# Altium project EPS.PrjPcb (part 2 of 4)

## Sheet EPS_I2C-Repeater.SchDoc: I2C Repeater
size A4; ApprovedBy: (not approved); CheckedBy: (not checked); Author: Piotr Kuligowski; DocumentNumber: PWSat2-xxx-DW-xxx; Revision: 2; SheetNumber: 15; SheetTotal: 51; Model: EM2
Used 2 times, as channels Top/Controller A/I2C Repeater, Top/Controller B/I2C Repeater. Parts and nets are listed once, with the designators drawn on the sheet.
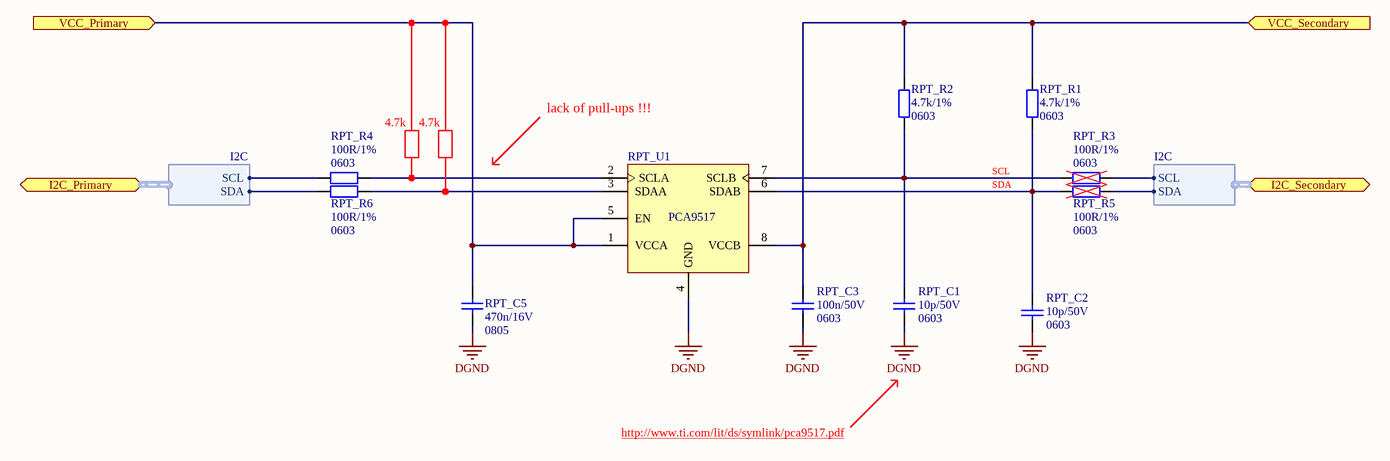
[diagram p9: EPS_I2C-Repeater.SchDoc]

### Parts
RPT_C1  Package: 0603  [SMD_Capacitor_0603]  (hidden comment: 10p/50V)
RPT_C2  Package: 0603  [SMD_Capacitor_0603]  (hidden comment: 10p/50V)
RPT_C3  Package: 0603  [SMD_Capacitor_0603]  (hidden comment: 100n/50V)
RPT_C5  value 470n/16V  Package: 0805  [SMD_Capacitor_0805]  (hidden comment: Cap)
RPT_R1  Package: 0603  [SMD_Resistor_0603]  (hidden comment: 4.7k/1%)
RPT_R2  Package: 0603  [SMD_Resistor_0603]  (hidden comment: 4.7k/1%)
RPT_R3  Package: 0603  [SMD_Resistor_0603]  (hidden comment: 100R/1%)
RPT_R4  Package: 0603  [SMD_Resistor_0603]  (hidden comment: 100R/1%)
RPT_R5  Package: 0603  [SMD_Resistor_0603]  (hidden comment: 100R/1%)
RPT_R6  Package: 0603  [SMD_Resistor_0603]  (hidden comment: 100R/1%)
RPT_U1  PCA9517  [TSSOP8_L]

### Ports
I2C_Primary (harness I2C), I2C_Secondary (harness I2C), VCC_Primary (in), VCC_Secondary (in)

### Harnesses
I2C: SDA, SCL

### Nets
DGND: RPT_C1.2 RPT_C2.2 RPT_C3.1 RPT_C5.2 RPT_U1.4(GND)
VCC_Primary: RPT_C5.1 RPT_U1.1(VCCA) RPT_U1.5(EN) ; port VCC_Primary
VCC_Secondary: RPT_C3.2 RPT_R1.1 RPT_R2.1 RPT_U1.8(VCCB) ; port VCC_Secondary
NetRPT_C1_1: RPT_C1.1 RPT_R2.2 RPT_R3.1 RPT_U1.7(SCLB)
NetRPT_C2_1: RPT_C2.1 RPT_R1.2 RPT_R5.1 RPT_U1.6(SDAB)
NetRPT_R3_2: RPT_R3.2 ; port I2C_Secondary.SCL
NetRPT_R4_1: RPT_R4.1 RPT_U1.2(SCLA)
NetRPT_R4_2: RPT_R4.2 ; port I2C_Primary.SCL
NetRPT_R5_2: RPT_R5.2 ; port I2C_Secondary.SDA
NetRPT_R6_1: RPT_R6.1 RPT_U1.3(SDAA)
NetRPT_R6_2: RPT_R6.2 ; port I2C_Primary.SDA

### Channels
Top/Controller A/I2C Repeater: designators end in _1; ports VCC_Primary=CTRLA_3V3d VCC_Secondary=CTRLA_3V3d
Top/Controller B/I2C Repeater: designators end in _2; ports VCC_Primary=CTRLB_3V3d VCC_Secondary=CTRLB_3V3d

### Notes on the sheet
- 4.7k
- lack of pull-ups !!!
- SCL
- SDA
- http://www.ti.com/lit/ds/symlink/pca9517.pdf
- Title:
- Project:
- Author:
- Model:
- Document Number:
- Checked by:
- Rev:
- Date:
- Approved by:
- Sheet:
- of
- File name:

### Library data of the parts
RPT_C1 RPT_C2 = Cer_GCM1885C1H100JA16D: Ceramic Cap Murata Automotive 10p/50V C0G 0603; Manufacturer: Murata; ManufacturerPartNumber: GCM1885C1H100JA16D; Value: 10p/50V
RPT_C3 = Cer_C0603T104K5RALTU: Ceramic Cap Kemet COTS 100n/50V X7R 0603; Manufacturer: Kemet; ManufacturerPartNumber: C0603T104K5RALTU; Value: 100n/50V
RPT_R1 RPT_R2 = CRCW06034K70FKxxxx: as CTRLA_R2 on sheet EPS_CTRL_A; Manufacturer: Vishay; ManufactuerPartNumber: CRCW06034K70FKxxxx; Value: 4.7k/1%
RPT_R3-RPT_R6 = CRCW0603100RFKxxxx: 100R/1% Vishay CRCW 0603 Resistor. 100mW, 100ppm, 75V.; Manufacturer: Vishay; ManufacturerPartNumber: CRCW0603100RFKxxxx; Value: 100R/1%
RPT_U1 = PCA9517: Level-Translating I2C Bus Repeater; Manufacturer: Texas Instruments; ManufacturerPartNumber: PCA9517

## Sheet EPS_CTRL_AB_Supply.SchDoc: CTRL-A and CTRL-B / Supply
size A4; ApprovedBy: (not approved); CheckedBy: (not checked); Author: Piotr Kuligowski; DocumentNumber: PWSat2-xxx-DW-xxx; Revision: 2; SheetNumber: 16; SheetTotal: 51; Model: EM2
Used 2 times, as channels Top/Controller A/CTRL-A_Supply, Top/Controller B/CTRL-B_Supply. Parts and nets are listed once, with the designators drawn on the sheet.
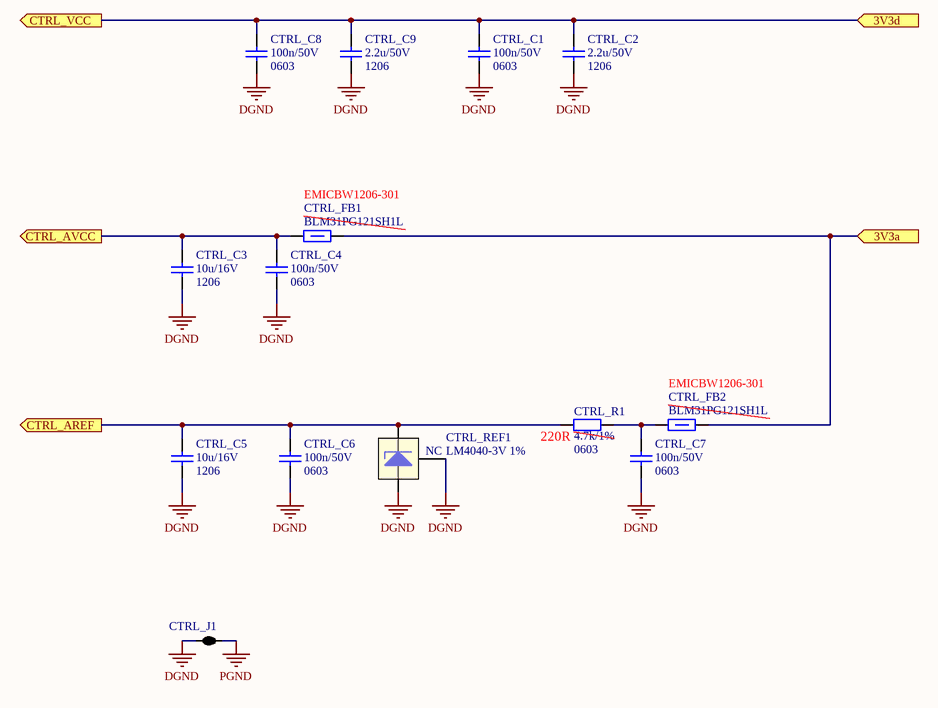
[diagram p10: EPS_CTRL_AB_Supply.SchDoc]

### Parts
CTRL_C1  Package: 0603  [SMD_Capacitor_0603]  (hidden comment: 100n/50V)
CTRL_C2  Package: 1206  [SMD_Capacitor_1206]  (hidden comment: 2.2u/50V)
CTRL_C3  Packge: 1206  [SMD_Capacitor_1206]  (hidden comment: 10u/16V)
CTRL_C4  Package: 0603  [SMD_Capacitor_0603]  (hidden comment: 100n/50V)
CTRL_C5  Packge: 1206  [SMD_Capacitor_1206]  (hidden comment: 10u/16V)
CTRL_C6  Package: 0603  [SMD_Capacitor_0603]  (hidden comment: 100n/50V)
CTRL_C7  Package: 0603  [SMD_Capacitor_0603]  (hidden comment: 100n/50V)
CTRL_C8  Package: 0603  [SMD_Capacitor_0603]  (hidden comment: 100n/50V)
CTRL_C9  Package: 1206  [SMD_Capacitor_1206]  (hidden comment: 2.2u/50V)
CTRL_FB1  120R/100MHz  [SMD_FerriteBead_1206]  (value not drawn)
CTRL_FB2  120R/100MHz  [SMD_FerriteBead_1206]  (value not drawn)
CTRL_J1  2 way net tie junction  [2way_LP]  (value not drawn)  (net tie, no BOM)
CTRL_R1  Package: 0603  [SMD_Resistor_0603]  (hidden comment: 4.7k/1%)
CTRL_REF1  LM4040-3V 1%  [SOT23-3]

### Ports
3V3a (in), 3V3d (in), CTRL_AREF (out), CTRL_AVCC (out), CTRL_VCC (out)

### Nets
DGND: CTRL_C1.2 CTRL_C2.2 CTRL_C3.2 CTRL_C4.2 CTRL_C5.2 CTRL_C6.2 CTRL_C7.2 CTRL_C8.2 CTRL_C9.2 CTRL_J1.2 CTRL_REF1.2(A) CTRL_REF1.3(NC)
PGND: CTRL_J1.1
3V3a: CTRL_FB1.1 CTRL_FB2.1 ; port 3V3a
3V3d: CTRL_C1.1 CTRL_C2.1 CTRL_C8.1 CTRL_C9.1 ; port CTRL_VCC, port 3V3d
CTRL_AREF: CTRL_C5.1 CTRL_C6.1 CTRL_R1.1 CTRL_REF1.1(K) ; port CTRL_AREF
CTRL_AVCC: CTRL_C3.1 CTRL_C4.1 CTRL_FB1.2 ; port CTRL_AVCC
NetCTRL_C7_1: CTRL_C7.1 CTRL_FB2.2 CTRL_R1.2

### Channels
Top/Controller A/CTRL-A_Supply: designators end in _1; ports 3V3a=CTRLA_3V3a 3V3d=CTRLA_3V3d CTRL_AREF=NetCTRL_C5_1_1 CTRL_AVCC=NetCTRL_C3_1_1 CTRL_VCC=CTRLA_3V3d
Top/Controller B/CTRL-B_Supply: designators end in _2; ports 3V3a=CTRLB_3V3a 3V3d=CTRLB_3V3d CTRL_AREF=CTRLB_Vref CTRL_AVCC=NetCTRL_C3_2_1 CTRL_VCC=CTRLB_3V3d

### Notes on the sheet
- (near CTRL_FB1) EMICBW1206-301
- (near CTRL_FB2) EMICBW1206-301
- (near CTRL_R1) 220R
- Title:
- Project:
- Author:
- Model:
- Document Number:
- Checked by:
- Rev:
- Date:
- Approved by:
- Sheet:
- of
- File name:

### Library data of the parts
CTRL_C1 CTRL_C4 CTRL_C6-CTRL_C8 = Cer_C0603T104K5RALTU: Ceramic Cap Kemet COTS 100n/50V X7R 0603; Manufacturer: Kemet; ManufacturerPartNumber: C0603T104K5RALTU; Value: 100n/50V
CTRL_C2 CTRL_C9 = Cer_GCJ31CR71H225KA12L: Ceramic Cap Murata Automotive 2.2u/50V X7R 1206; Manufacturer: Murata; ManufacturerPartNumber: GCJ31CR71H225KA12L; Value: 2.2u/50V
CTRL_C3 CTRL_C5 = Cer_C1206T106K4RACTU: Ceramic Cap Kemet COTS 10u/16V X7R 1206; ManufacturerPartNumber: C1206T106K4RACTU; Manufacturer: Kemet; Value: 10u/16V
CTRL_FB1 CTRL_FB2 = BLM31PG121SH1L: as EMIAB_FB1 on sheet EPS_3V3_EMI-Filter_Out; Package: 1206; Value: 120R/100MHz; ManufacturerPartNumber: BLM31PG121SH1L
CTRL_J1 = 2way: ComponentLink1URL: http://www.edatools.cz/addons; ComponentLink1Description: Source; FootprintNote: LP=12mil, MP=40mil, HP=120mil
CTRL_R1 = Res: Value: 4.7k/1%
CTRL_REF1 = LM4040DIM3-3.0: Shunt V-REF, 3V, 1%, SOT23-3; Manufacturer: Texas Instruments; ManufacturerPartNumber: LM4040DIM3-3.0; HelpUrl: http://www.ti.com/lit/ds/symlink/lm4040-n.pdf; Value: LM4040-3V 1%

## Sheet EPS_Temperature-Sensor.SchDoc: Temperature Sensor
size A4; ApprovedBy: (not approved); CheckedBy: (not checked); Author: P. Kuligowski; DocumentNumber: PWSat2-xxx-DW-xxx; Revision: 2; SheetNumber: 14; SheetTotal: 51; Model: EM2
Used 4 times, as channels Top/Controller A/Temperature-Sensor, Top/Local-Supply and WDTs/Local-Supply CTRL-A/Temperature-Sensor, Top/Local-Supply and WDTs/Local-Supply CTRL-B/Temperature-Sensor, Top/Controller B/Temperature-Sensor. Parts and nets are listed once, with the designators drawn on the sheet.
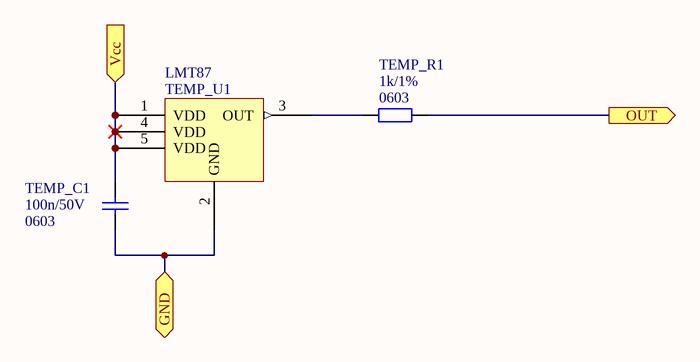
[diagram p11: EPS_Temperature-Sensor.SchDoc]

### Parts
TEMP_C1  Package: 0603  [SMD_Capacitor_0603]  (hidden comment: 100n/50V)
TEMP_R1  Package: 0603  [SMD_Resistor_0603]  (hidden comment: 1k/1%)
TEMP_U1  LMT87  [SC70-LT5_N]

### Ports
GND, OUT (out), Vcc (in)

### Nets
GND: TEMP_C1.2 TEMP_U1.2(GND) ; port GND
OUT: TEMP_R1.2 ; port OUT
Vcc: TEMP_C1.1 TEMP_U1.1(VDD) TEMP_U1.4(VDD) TEMP_U1.5(VDD) ; port Vcc
NetTEMP_R1_1: TEMP_R1.1 TEMP_U1.3(OUT)

### Channels
Top/Controller A/Temperature-Sensor: designators end in _1; ports GND=DGND OUT=CTRLA_HK_TEMP Vcc=NetCTRLA_R21_1
Top/Local-Supply and WDTs/Local-Supply CTRL-A/Temperature-Sensor: designators end in _2; ports GND=PGND OUT=CTRLA_HK_SUPP_TEMP Vcc=NetTEMP_C1_2_1
Top/Local-Supply and WDTs/Local-Supply CTRL-B/Temperature-Sensor: designators end in _3; ports GND=PGND OUT=CTRLB_HK_SUPP_TEMP Vcc=NetTEMP_C1_3_1
Top/Controller B/Temperature-Sensor: designators end in _4; ports GND=DGND OUT=CTRLB_HK_TEMP Vcc=NetCTRLB_R10_1

### Notes on the sheet
- Title:
- Project:
- Author:
- Model:
- Document Number:
- Checked by:
- Rev:
- Date:
- Approved by:
- Sheet:
- of
- File name:

### Library data of the parts
TEMP_C1 = Cer_C0603T104K5RALTU: Ceramic Cap Kemet COTS 100n/50V X7R 0603; Manufacturer: Kemet; ManufacturerPartNumber: C0603T104K5RALTU; Value: 100n/50V
TEMP_R1 = CRCW06031K00FKxxxx: 1k/1% Vishay CRCW 0603 Resistor. 100mW, 100ppm, 75V.; Manufacturer: Vishay; ManufacturerPartNumber: CRCW06031K00FKxxxx; Value: 1k/1%
TEMP_U1 = LMT87: Analog Temperature Sensors with Class-AB Output

## Sheet EPS_MPPT_X.SchDoc: MPPT-X
size A3; ApprovedBy: (not approved); CheckedBy: (not checked); Author: Piotr Kuligowski; DocumentNumber: PWSat2-xxx-DW-xxx; Revision: 2; SheetNumber: 4; SheetTotal: 51; Model: EM2
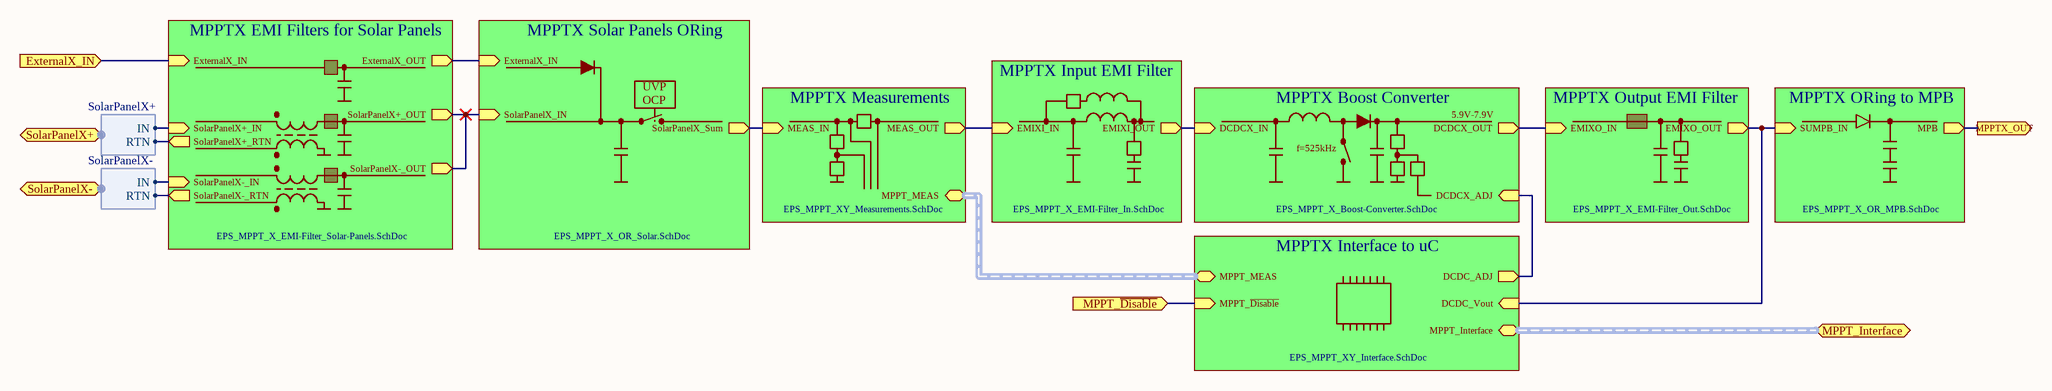
[diagram p12: EPS_MPPT_X.SchDoc]

### Sub-sheets
MPPTX Boost Converter = EPS_MPPT_X_Boost-Converter.SchDoc: DCDCX_IN (in), DCDCX_OUT (out), DCDCX_ADJ (in)
MPPTX EMI Filters for Solar Panels = EPS_MPPT_X_EMI-Filter_Solar-Panels.SchDoc: SolarPanelX+_RTN (out), SolarPanelX-_IN (in), ExternalX_IN (in), SolarPanelX-_RTN (out), SolarPanelX+_IN (in), ExternalX_OUT (out), SolarPanelX-_OUT (out), SolarPanelX+_OUT (out)
MPPTX Input EMI Filter = EPS_MPPT_X_EMI-Filter_In.SchDoc (file not in this document): EMIXI_OUT (out), EMIXI_IN (in)
MPPTX Interface to uC = EPS_MPPT_XY_Interface.SchDoc: MPPT_Interface (harness MPPT_Interface), DCDC_Vout (in), MPPT_MEAS (harness MPPT_MEAS), DCDC_ADJ (out), MPPT_~{Disable} (in)
MPPTX Measurements = EPS_MPPT_XY_Measurements.SchDoc: MEAS_IN (in), MEAS_OUT (out), MPPT_MEAS (harness MPPT_MEAS)
MPPTX ORing to MPB = EPS_MPPT_X_OR_MPB.SchDoc: MPB (out), SUMPB_IN (in)
MPPTX Output EMI Filter = EPS_MPPT_X_EMI-Filter_Out.SchDoc: EMIXO_OUT (out), EMIXO_IN (in)
MPPTX Solar Panels ORing = EPS_MPPT_X_OR_Solar.SchDoc: ExternalX_IN (in), SolarPanelX_Sum (out), SolarPanelX_IN (in)

### Ports
ExternalX_IN (in), MPPT_Interface (harness MPPT_Interface), MPPT_~{Disable} (in), MPPTX_OUT (out), SolarPanelX+ (harness SolarPanelX+), SolarPanelX- (harness SolarPanelX-)

### Harnesses
SolarPanelX+: IN, RTN
SolarPanelX-: IN, RTN

### Nets
PC-104_EXTX: port ExternalX_IN, sheet MPPTX EMI Filters for Solar Panels/ExternalX_IN
NetCTRLB_U1_1: port MPPT_~{Disable}, sheet MPPTX Interface to uC/MPPT_~{Disable}
NetDCDCX_C1_2: sheet MPPTX Boost Converter/DCDCX_IN, sheet MPPTX Input EMI Filter/EMIXI_OUT
NetDCDCX_C2_2: sheet MPPTX Boost Converter/DCDCX_OUT, sheet MPPTX Output EMI Filter/EMIXO_IN
NetDCDCX_R7_2: sheet MPPTX Boost Converter/DCDCX_ADJ, sheet MPPTX Interface to uC/DCDC_ADJ
NetEMIXO_C1_1: sheet MPPTX Interface to uC/DCDC_Vout, sheet MPPTX Output EMI Filter/EMIXO_OUT, sheet MPPTX ORing to MPB/SUMPB_IN
NetEMIXS_C1_1: sheet MPPTX Solar Panels ORing/ExternalX_IN, sheet MPPTX EMI Filters for Solar Panels/ExternalX_OUT
NetEMIXS_C2_1: sheet MPPTX Solar Panels ORing/SolarPanelX_IN, sheet MPPTX EMI Filters for Solar Panels/SolarPanelX-_OUT, sheet MPPTX EMI Filters for Solar Panels/SolarPanelX+_OUT
NetEMIXS_T1_1: sheet MPPTX EMI Filters for Solar Panels/SolarPanelX+_IN, port SolarPanelX+.IN
NetEMIXS_T1_2: sheet MPPTX EMI Filters for Solar Panels/SolarPanelX+_RTN, port SolarPanelX+.RTN
NetEMIXS_T2_1: sheet MPPTX EMI Filters for Solar Panels/SolarPanelX-_IN, port SolarPanelX-.IN
NetEMIXS_T2_2: sheet MPPTX EMI Filters for Solar Panels/SolarPanelX-_RTN, port SolarPanelX-.RTN
NetH3_2: port MPPTX_OUT, sheet MPPTX ORing to MPB/MPB
NetMEAS_R1_1_1: sheet MPPTX Solar Panels ORing/SolarPanelX_Sum, sheet MPPTX Measurements/MEAS_IN
NetMEAS_R1_1_4: sheet MPPTX Measurements/MEAS_OUT, sheet MPPTX Input EMI Filter/EMIXI_IN

### Buses and harness runs
harness port MPPT_Interface = sheet MPPTX Interface to uC/MPPT_Interface
harness sheet MPPTX Interface to uC/MPPT_MEAS = sheet MPPTX Measurements/MPPT_MEAS

### Notes on the sheet
- UVP
- OCP
- f=525kHz
- 5.9V-7.9V
- Title:
- Project:
- Author:
- Model:
- Document Number:
- Checked by:
- Rev:
- Date:
- Approved by:
- Sheet:
- of
- File name:

## Sheet EPS_MPPT_X_Boost-Converter.SchDoc: MPPT-X / Boost-Converter
size A3; ApprovedBy: (not approved); CheckedBy: (not checked); Author: Piotr Kuligowski; DocumentNumber: PWSat2-xxx-DW-xxx; Revision: 2; SheetNumber: 9; SheetTotal: 51; Model: EM2
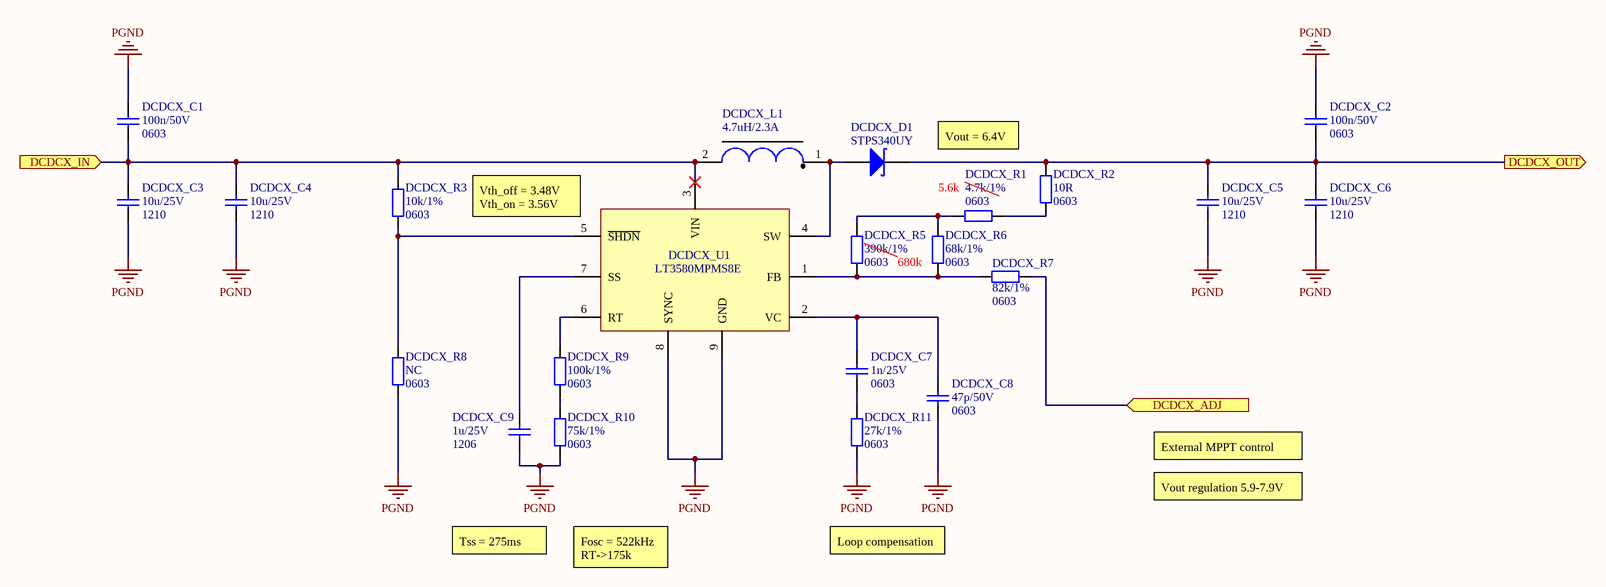
[diagram p13: EPS_MPPT_X_Boost-Converter.SchDoc]

### Parts
DCDCX_C1  Package: 0603  [SMD_Capacitor_0603]  (hidden comment: 100n/50V)
DCDCX_C2  Package: 0603  [SMD_Capacitor_0603]  (hidden comment: 100n/50V)
DCDCX_C3  Package: 1210  [SMD_Capacitor_1210]  (hidden comment: 10u/25V)
DCDCX_C4  Package: 1210  [SMD_Capacitor_1210]  (hidden comment: 10u/25V)
DCDCX_C5  Package: 1210  [SMD_Capacitor_1210]  (hidden comment: 10u/25V)
DCDCX_C6  Package: 1210  [SMD_Capacitor_1210]  (hidden comment: 10u/25V)
DCDCX_C7  value 1n/25V  Package: 0603  [SMD_Capacitor_0603]  (hidden comment: Cap)
DCDCX_C8  value 47p/50V  Package: 0603  [SMD_Capacitor_0603]  (hidden comment: Cap)
DCDCX_C9  Package: 1206  [SMD_Capacitor_1206]  (hidden comment: 1u/25V)
DCDCX_D1  STPS340UY  [DO-214AA]
DCDCX_L1  4.7uH/2.3A  [Coilcraft_MSS6132]
DCDCX_R1  Package: 0603  [SMD_Resistor_0603]  (hidden comment: 4.7k/1%)
DCDCX_R2  Package: 0603  [SMD_Resistor_0603]  (hidden comment: 10R)
DCDCX_R3  Package: 0603  [SMD_Resistor_0603]  (hidden comment: 10k/1%)
DCDCX_R5  Package: 0603  [SMD_Resistor_0603]  (hidden comment: 390k/1%)
DCDCX_R6  Package: 0603  [SMD_Resistor_0603]  (hidden comment: 68k/1%)
DCDCX_R7  Package: 0603  [SMD_Resistor_0603]  (hidden comment: 82k/1%)
DCDCX_R8  Package: 0603  [SMD_Resistor_0603]  (hidden comment: NC)
DCDCX_R9  Package: 0603  [SMD_Resistor_0603]  (hidden comment: 100k/1%)
DCDCX_R10  Package: 0603  [SMD_Resistor_0603]  (hidden comment: 75k/1%)
DCDCX_R11  Package: 0603  [SMD_Resistor_0603]  (hidden comment: 27k/1%)
DCDCX_U1  (no value)  [LT-MS8E-8-1880X1680TP_N]

### Ports
DCDCX_ADJ (in), DCDCX_IN (in), DCDCX_OUT (out)

### Nets
PGND: DCDCX_C1.1 DCDCX_C2.1 DCDCX_C3.2 DCDCX_C4.2 DCDCX_C5.2 DCDCX_C6.2 DCDCX_C8.2 DCDCX_C9.2 DCDCX_R8.2 DCDCX_R10.2 DCDCX_R11.2 DCDCX_U1.8(SYNC) DCDCX_U1.9(GND)
NetDCDCX_C1_2: DCDCX_C1.2 DCDCX_C3.1 DCDCX_C4.1 DCDCX_L1.2 DCDCX_R3.1 DCDCX_U1.3(VIN) ; port DCDCX_IN
NetDCDCX_C2_2: DCDCX_C2.2 DCDCX_C5.1 DCDCX_C6.1 DCDCX_D1.K DCDCX_R2.2 ; port DCDCX_OUT
NetDCDCX_C7_1: DCDCX_C7.1 DCDCX_C8.1 DCDCX_U1.2(VC)
NetDCDCX_C7_2: DCDCX_C7.2 DCDCX_R11.1
NetDCDCX_C9_1: DCDCX_C9.1 DCDCX_U1.7(SS)
NetDCDCX_D1_A: DCDCX_D1.A DCDCX_L1.1 DCDCX_U1.4(SW)
NetDCDCX_R1_1: DCDCX_R1.1 DCDCX_R5.1 DCDCX_R6.1
NetDCDCX_R1_2: DCDCX_R1.2 DCDCX_R2.1
NetDCDCX_R3_2: DCDCX_R3.2 DCDCX_R8.1 DCDCX_U1.5(~{SHDN})
NetDCDCX_R5_2: DCDCX_R5.2 DCDCX_R6.2 DCDCX_R7.1 DCDCX_U1.1(FB)
NetDCDCX_R7_2: DCDCX_R7.2 ; port DCDCX_ADJ
NetDCDCX_R9_1: DCDCX_R9.1 DCDCX_U1.6(RT)
NetDCDCX_R9_2: DCDCX_R9.2 DCDCX_R10.1

### Notes on the sheet
- Vout = 6.4V
- (near DCDCX_U1) Vth_off = 3.48V
  Vth_on = 3.56V
- (near DCDCX_R1) 5.6k
- (near DCDCX_R6) 680k
- External MPPT control
- Vout regulation 5.9-7.9V
- Tss = 275ms
- Fosc = 522kHz
  RT->175k
- Loop compensation
- Title:
- Project:
- Author:
- Model:
- Document Number:
- Checked by:
- Rev:
- Date:
- Approved by:
- Sheet:
- of
- File name:

### Library data of the parts
DCDCX_C1 DCDCX_C2 = Cer_C0603T104K5RALTU: Ceramic Cap Kemet COTS 100n/50V X7R 0603; Manufacturer: Kemet; ManufacturerPartNumber: C0603T104K5RALTU; Value: 100n/50V
DCDCX_C3-DCDCX_C6 = Cer_GCJ32ER71E106KA12L: Ceramic Cap Murata Automotive 10u/25V X7R 1210; Manufacturer: Murata; ManufacturerPartNumber: GCJ32ER71E106KA12L; Value: 10u/25V
DCDCX_C9 = Cer_C1206T105K3RALTU: Ceramic Cap Kemet COTS 1u/25V X7R 1206; ManufacturerPartNumber: C1206T105K3RALTU; Manufacturer: Kemet; Value: 1u/25V
DCDCX_D1 = STPS340x: 3A/40V Power Schottky Rectifier.; Manufacturer: STMicroelectronics; Value: STPS340UY
DCDCX_L1 = MSS6132-472MLx: Coilcraft MSS6132 Inductor, L=4.7uH, Irise20deg=2.3A, ESR=43mR, SRF=65MHz.; Manufacturer: Coilcraft; ManufacturerPartNumber: MSS6132-472MLx; Value: 4.7uH/2.3A
DCDCX_R1-DCDCX_R3 DCDCX_R5-DCDCX_R11 = Res
  DCDCX_R1: Value: 4.7k/1%
  DCDCX_R2: Value: 10R
  DCDCX_R3: Value: 10k/1%
  DCDCX_R5: Value: 390k/1%
  DCDCX_R6: Value: 68k/1%
  DCDCX_R7: Value: 82k/1%
  DCDCX_R8: Value: NC
  DCDCX_R9: Value: 100k/1%
  DCDCX_R10: Value: 75k/1%
  DCDCX_R11: Value: 27k/1%
DCDCX_U1 = LT3580MPMS8E: Boost Conv 2A, Soft-Start, Synchro; Manufacturer: Linear Technology; ManufacturerPartNumber: LT3580MPMS8E; HelpUrl: http://cds.linear.com/docs/en/datasheet/3580fg.pdf

## Sheet EPS_MPPT_X_OR_Solar.SchDoc: MPPT-X / Solar Panels ORing
size A4; ApprovedBy: (not approved); CheckedBy: (not checked); Author: Piotr Kuligowski; DocumentNumber: PWSat2-xxx-DW-xxx; Revision: 2; SheetNumber: 6; SheetTotal: 51; Model: EM2
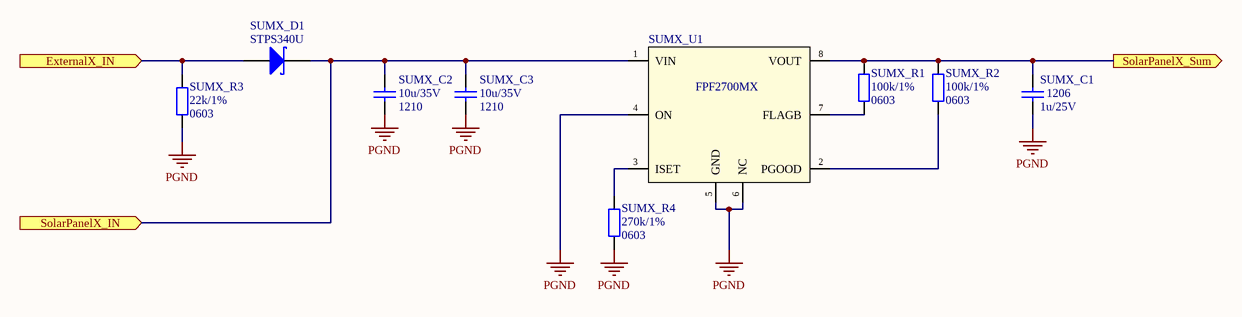
[diagram p14: EPS_MPPT_X_OR_Solar.SchDoc]

### Parts
SUMX_C1  Package: 1206  [SMD_Capacitor_1206]  (hidden comment: 1u/25V)
SUMX_C2  Package: 1210  [SMD_Capacitor_1210]  (hidden comment: 10u/35V)
SUMX_C3  Package: 1210  [SMD_Capacitor_1210]  (hidden comment: 10u/35V)
SUMX_D1  STPS340U  [DO-214AA]
SUMX_R1  Package: 0603  [SMD_Resistor_0603]  (hidden comment: 100k/1%)
SUMX_R2  Package: 0603  [SMD_Resistor_0603]  (hidden comment: 100k/1%)
SUMX_R3  Package: 0603  [SMD_Resistor_0603]  (hidden comment: 22k/1%)
SUMX_R4  Package: 0603  [SMD_Resistor_0603]  (hidden comment: 270k/1%)
SUMX_U1  FPF2700MX  [SOIC-8-N]

### Ports
ExternalX_IN (in), SolarPanelX_IN (in), SolarPanelX_Sum (out)

### Nets
PGND: SUMX_C1.2 SUMX_C2.2 SUMX_C3.2 SUMX_R3.2 SUMX_R4.2 SUMX_U1.4(ON) SUMX_U1.5(GND) SUMX_U1.6(NC)
NetEMIXS_C1_1: SUMX_D1.A SUMX_R3.1 ; port ExternalX_IN
NetEMIXS_C2_1: SUMX_C2.1 SUMX_C3.1 SUMX_D1.K SUMX_U1.1(VIN) ; port SolarPanelX_IN
NetMEAS_R1_1_1: SUMX_C1.1 SUMX_R1.1 SUMX_R2.1 SUMX_U1.8(VOUT) ; port SolarPanelX_Sum
NetSUMX_R1_2: SUMX_R1.2 SUMX_U1.7(FLAGB)
NetSUMX_R2_2: SUMX_R2.2 SUMX_U1.2(PGOOD)
NetSUMX_R4_1: SUMX_R4.1 SUMX_U1.3(ISET)

### Notes on the sheet
- Title:
- Project:
- Author:
- Model:
- Document Number:
- Checked by:
- Rev:
- Date:
- Approved by:
- Sheet:
- of
- File name:

### Library data of the parts
SUMX_C1 = Cer_C1206T105K3RALTU: Ceramic Cap Kemet COTS 1u/25V X7R 1206; ManufacturerPartNumber: C1206T105K3RALTU; Manufacturer: Kemet; Value: 1u/25V
SUMX_C2 SUMX_C3 = Cer_GCM32EC7YA106KA03K: Ceramic Cap Murata Automotive 10u/35V X7S 1210; Manufacturer: Murata; ManufacturerPartNumber: GCM32EC7YA106KA03K; Value: 10u/35V
SUMX_D1 = STPS340x: as DCDCX_D1 on sheet EPS_MPPT_X_Boost-Converter; Value: STPS340U
SUMX_R1-SUMX_R4 = Res
  SUMX_R1 SUMX_R2: Value: 100k/1%
  SUMX_R3: Value: 22k/1%
  SUMX_R4: Value: 270k/1%
SUMX_U1 = FPF2700MX: Adj over-current protection 0.4-2A, Load Switch; Manufacturer: Fairchild Semiconductor; Value: FPF2700MX

## Sheet EPS_MPPT_X_EMI-Filter_Solar-Panels.SchDoc: MPPTX EMI Filters for Solar Panels
size A4; Date: 2015-02-21; Author: Piotr Kuligowski; DocumentNumber: PWSat2-xxx-DW-xxx; Revision: 1-0; SheetNumber: 5; SheetTotal: 51; Model: EM1
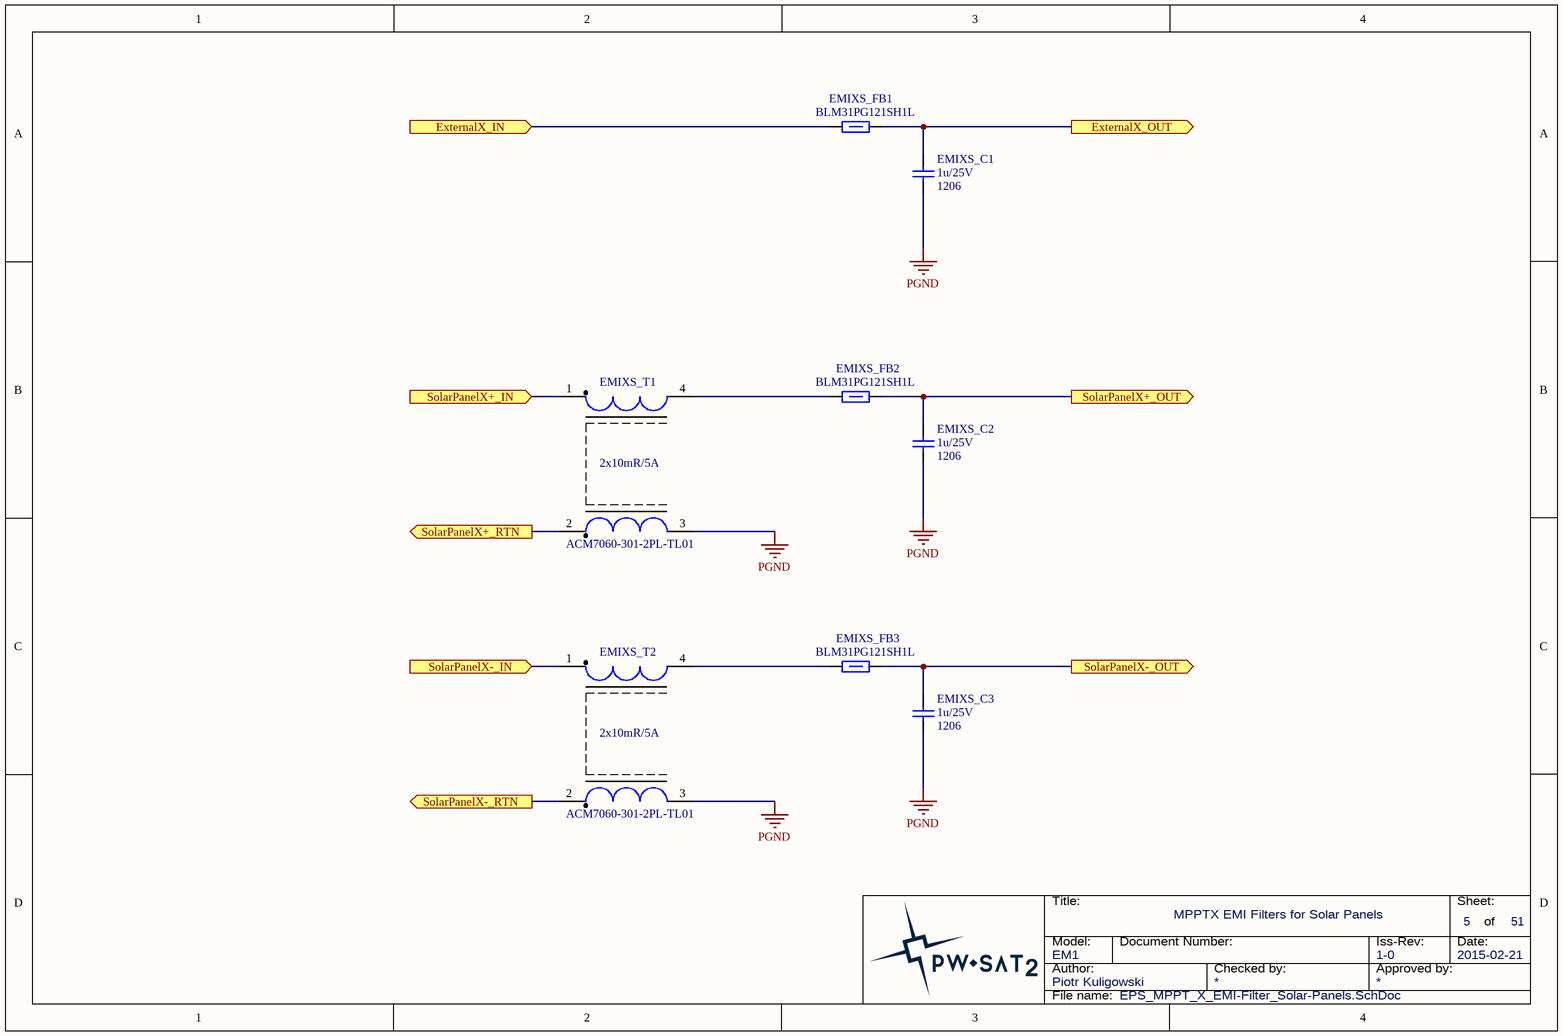
[diagram p15: EPS_MPPT_X_EMI-Filter_Solar-Panels.SchDoc]

### Parts
EMIXS_C1  Package: 1206  [SMD_Capacitor_1206]  (hidden comment: 1u/25V)
EMIXS_C2  Package: 1206  [SMD_Capacitor_1206]  (hidden comment: 1u/25V)
EMIXS_C3  Package: 1206  [SMD_Capacitor_1206]  (hidden comment: 1u/25V)
EMIXS_FB1  120R/100MHz  [SMD_FerriteBead_1206]  (value not drawn)
EMIXS_FB2  120R/100MHz  [SMD_FerriteBead_1206]  (value not drawn)
EMIXS_FB3  120R/100MHz  [SMD_FerriteBead_1206]  (value not drawn)
EMIXS_T1  2x10mR/5A  [TDK_ACM7060]
EMIXS_T2  2x10mR/5A  [TDK_ACM7060]

### Ports
ExternalX_IN (in), ExternalX_OUT (out), SolarPanelX+_IN (in), SolarPanelX+_OUT (out), SolarPanelX+_RTN (out), SolarPanelX-_IN (in), SolarPanelX-_OUT (out), SolarPanelX-_RTN (out)

### Nets
PGND: EMIXS_C1.2 EMIXS_C2.2 EMIXS_C3.2 EMIXS_T1.3 EMIXS_T2.3
PC-104_EXTX: EMIXS_FB1.2 ; port ExternalX_IN
NetEMIXS_C1_1: EMIXS_C1.1 EMIXS_FB1.1 ; port ExternalX_OUT
NetEMIXS_C2_1: EMIXS_C2.1 EMIXS_C3.1 EMIXS_FB2.1 EMIXS_FB3.1 ; port SolarPanelX-_OUT, port SolarPanelX+_OUT
NetEMIXS_FB2_2: EMIXS_FB2.2 EMIXS_T1.4
NetEMIXS_FB3_2: EMIXS_FB3.2 EMIXS_T2.4
NetEMIXS_T1_1: EMIXS_T1.1 ; port SolarPanelX+_IN
NetEMIXS_T1_2: EMIXS_T1.2 ; port SolarPanelX+_RTN
NetEMIXS_T2_1: EMIXS_T2.1 ; port SolarPanelX-_IN
NetEMIXS_T2_2: EMIXS_T2.2 ; port SolarPanelX-_RTN

### Notes on the sheet
- Title:
- Sheet:
- of
- Author:
- Model:
- Document Number:
- Checked by:
- Iss-Rev:
- Approved by:
- Date:
- File name:

### Library data of the parts
EMIXS_C1-EMIXS_C3 = Cer_C1206T105K3RALTU: Ceramic Cap Kemet COTS 1u/25V X7R 1206; ManufacturerPartNumber: C1206T105K3RALTU; Manufacturer: Kemet; Value: 1u/25V
EMIXS_FB1-EMIXS_FB3 = BLM31PG121SH1L: Ferrite bead, 1206, 0.02HM, 3.5A.; Manufacturer: Murata; Current Rating: 3.5A; Series Resistance DC: 0.02R; Package: 1206; Value: 120R/100MHz; ManufacturerPartNumber: BLM31PG121SH1L
EMIXS_T1 EMIXS_T2 = ACM7060-301-2PL-TL01: TDK ACM7060-301 Common Mode Choke; Manufacturer: TDK; ManufacturerPartNumber: ACM7060-301-2PL-TL01; Value: 2x10mR/5A

## Sheet EPS_MPPT_XY_Interface.SchDoc: MPPT-X and MPPT-Y / Interface
size A4; Date: 2015-10-14; ApprovedBy: (not approved); CheckedBy: (not checked); Author: Piotr Kuligowski; DocumentNumber: PWSat2-xxx-DW-xxx; Revision: 2; SheetNumber: 10; SheetTotal: 51; Model: EM2
Used 3 times, as channels Top/MPPT X/MPPTX Interface to uC, Top/MPPT Y+/MPPTY Interface to uC, Top/MPPT Y-/MPPTY Interface to uC. Parts and nets are listed once, with the designators drawn on the sheet.
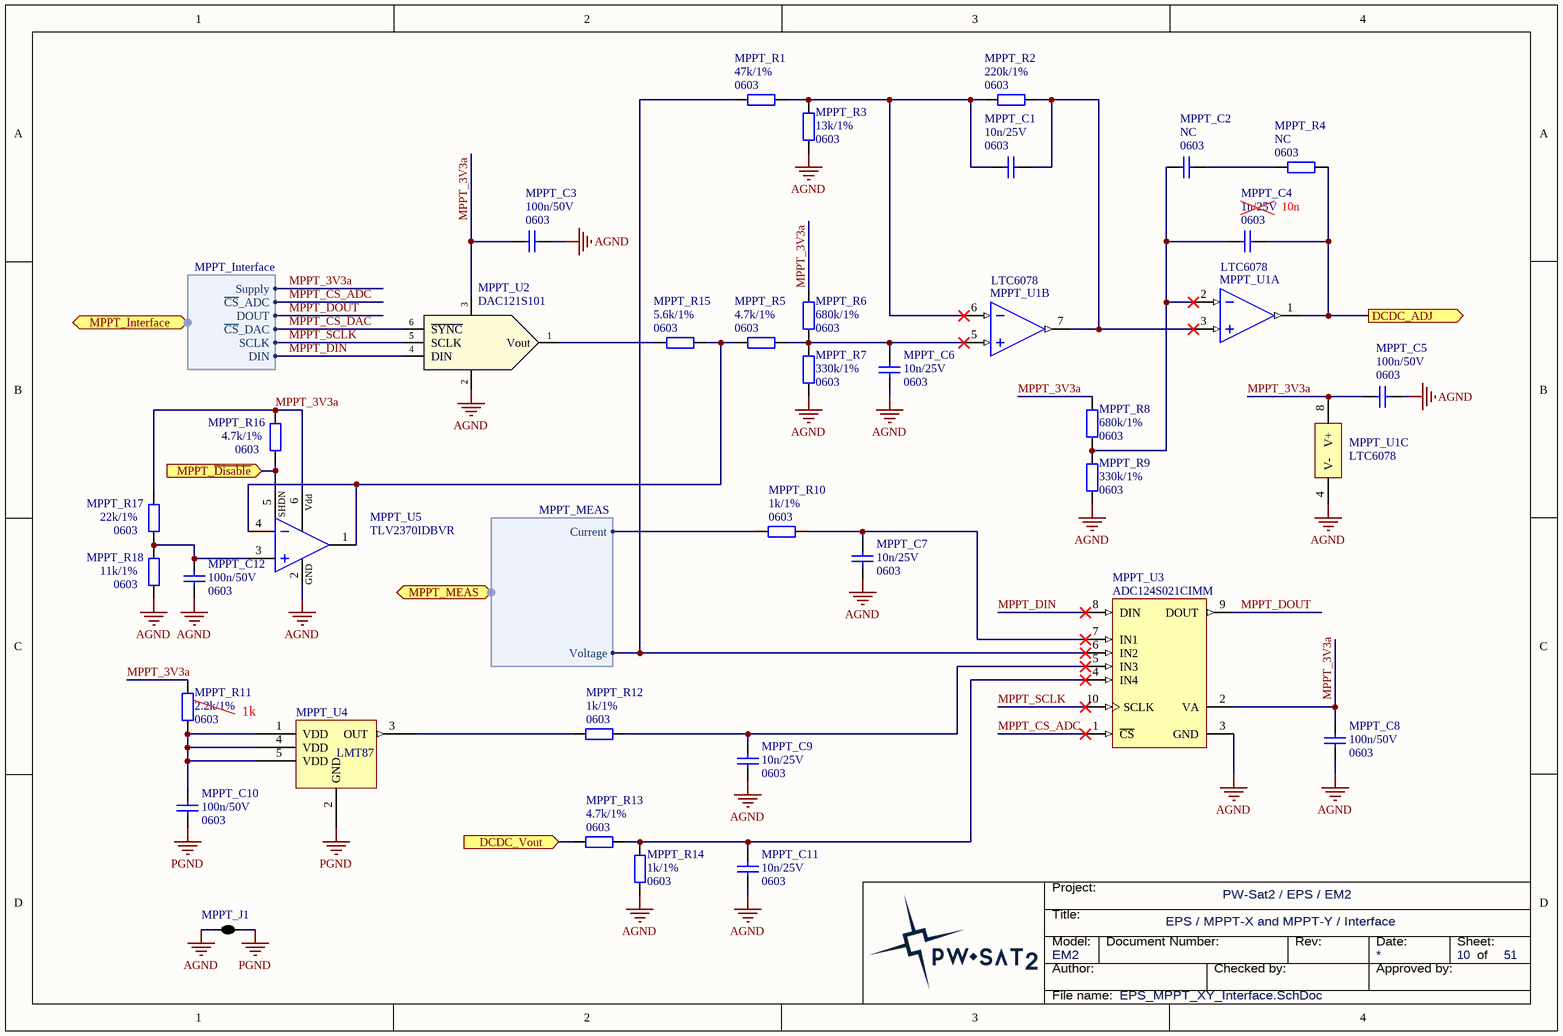
[diagram p16: EPS_MPPT_XY_Interface.SchDoc]

### Parts
MPPT_C1  value 10n/25V  Package: 0603  [SMD_Capacitor_0603]  (hidden comment: Cap)
MPPT_C2  value NC  Package: 0603  [SMD_Capacitor_0603]  (hidden comment: Cap)
MPPT_C3  Package: 0603  [SMD_Capacitor_0603]  (hidden comment: 100n/50V)
MPPT_C4  value 1n/25V  Package: 0603  [SMD_Capacitor_0603]  (hidden comment: Cap)
MPPT_C5  Package: 0603  [SMD_Capacitor_0603]  (hidden comment: 100n/50V)
MPPT_C6  value 10n/25V  Package: 0603  [SMD_Capacitor_0603]  (hidden comment: Cap)
MPPT_C7  value 10n/25V  Package: 0603  [SMD_Capacitor_0603]  (hidden comment: Cap)
MPPT_C8  Package: 0603  [SMD_Capacitor_0603]  (hidden comment: 100n/50V)
MPPT_C9  value 10n/25V  Package: 0603  [SMD_Capacitor_0603]  (hidden comment: Cap)
MPPT_C10  Package: 0603  [SMD_Capacitor_0603]  (hidden comment: 100n/50V)
MPPT_C11  value 10n/25V  Package: 0603  [SMD_Capacitor_0603]  (hidden comment: Cap)
MPPT_C12  value 100n/50V  Package: 0603  [SMD_Capacitor_0603]  (hidden comment: Cap)
MPPT_J1  2 way net tie junction  [2way_LP]  (value not drawn)  (net tie, no BOM)
MPPT_R1  Package: 0603  [SMD_Resistor_0603]  (hidden comment: 47k/1%)
MPPT_R2  Package: 0603  [SMD_Resistor_0603]  (hidden comment: 220k/1%)
MPPT_R3  Package: 0603  [SMD_Resistor_0603]  (hidden comment: 13k/1%)
MPPT_R4  Package: 0603  [SMD_Resistor_0603]  (hidden comment: NC)
MPPT_R5  Package: 0603  [SMD_Resistor_0603]  (hidden comment: 4.7k/1%)
MPPT_R6  Package: 0603  [SMD_Resistor_0603]  (hidden comment: 680k/1%)
MPPT_R7  Package: 0603  [SMD_Resistor_0603]  (hidden comment: 330k/1%)
MPPT_R8  Package: 0603  [SMD_Resistor_0603]  (hidden comment: 680k/1%)
MPPT_R9  Package: 0603  [SMD_Resistor_0603]  (hidden comment: 330k/1%)
MPPT_R10  Package: 0603  [SMD_Resistor_0603]  (hidden comment: 1k/1%)
MPPT_R11  Package: 0603  [SMD_Resistor_0603]  (hidden comment: 2.2k/1%)
MPPT_R12  Package: 0603  [SMD_Resistor_0603]  (hidden comment: 1k/1%)
MPPT_R13  Package: 0603  [SMD_Resistor_0603]  (hidden comment: 4.7k/1%)
MPPT_R14  Package: 0603  [SMD_Resistor_0603]  (hidden comment: 1k/1%)
MPPT_R15  Package: 0603  [SMD_Resistor_0603]  (hidden comment: 5.6k/1%)
MPPT_R16  Package: 0603  [SMD_Resistor_0603]  (hidden comment: 4.7k/1%)
MPPT_R17  Package: 0603  [SMD_Resistor_0603]  (hidden comment: 22k/1%)
MPPT_R18  Package: 0603  [SMD_Resistor_0603]  (hidden comment: 11k/1%)
MPPT_U1  LTC6078  [MSOP-8]  (parts A,B,C of 3)
MPPT_U2  DAC121S101  [SOT23-6]
MPPT_U3  ADC124S021CIMM  [MUB10A_L]
MPPT_U4  LMT87  [SC70-LT5_N]
MPPT_U5  (no value)  [SOT23-6]

### Ports
DCDC_ADJ (out), DCDC_Vout (in), MPPT_Interface (harness MPPT_Interface), MPPT_MEAS (harness MPPT_MEAS), MPPT_~{Disable} (in)

### Harnesses
MPPT_Interface: DIN, DOUT, SCLK, ~{CS}_DAC, ~{CS}_ADC, Supply
MPPT_MEAS: Voltage, Current

### Nets
AGND: MPPT_C3.1 MPPT_C5.2 MPPT_C6.1 MPPT_C7.1 MPPT_C8.2 MPPT_C9.1 MPPT_C11.1 MPPT_C12.1 MPPT_J1.2 MPPT_R3.1 MPPT_R7.1 MPPT_R9.1 MPPT_R14.1 MPPT_R18.2 MPPT_U1.4(V-) MPPT_U2.2(GND) MPPT_U3.3(GND) MPPT_U5.2(GND)
PGND: MPPT_C10.2 MPPT_J1.1 MPPT_U4.2(GND)
DCDC_ADJ: MPPT_C4.2 MPPT_R4.1 MPPT_U1.1(OUT_A) ; port DCDC_ADJ
DCDC_Vout: MPPT_R13.2 ; port DCDC_Vout
MPPT_3V3a: MPPT_C3.2 MPPT_C5.1 MPPT_C8.1 MPPT_R6.2 MPPT_R8.2 MPPT_R11.1 MPPT_R16.1 MPPT_R17.1 MPPT_U1.8(V+) MPPT_U2.3(Va) MPPT_U3.2(VA) MPPT_U5.6(Vdd) ; port MPPT_Interface.Supply
MPPT_CS_ADC: MPPT_U3.1(~{CS}) ; port MPPT_Interface.~{CS}_ADC
MPPT_CS_DAC: MPPT_U2.6(~{SYNC}) ; port MPPT_Interface.~{CS}_DAC
MPPT_~{Disable}: MPPT_R16.2 MPPT_U5.5(SHDN) ; port MPPT_~{Disable}
MPPT_DIN: MPPT_U2.4(DIN) MPPT_U3.8(DIN) ; port MPPT_Interface.DIN
MPPT_DOUT: MPPT_U3.9(DOUT) ; port MPPT_Interface.DOUT
MPPT_SCLK: MPPT_U2.5(SCLK) MPPT_U3.10(SCLK) ; port MPPT_Interface.SCLK
NetMPPT_C1_1: MPPT_C1.1 MPPT_R1.1 MPPT_R2.2 MPPT_R3.2 MPPT_U1.6(IN-_B)
NetMPPT_C1_2: MPPT_C1.2 MPPT_R2.1 MPPT_U1.3(IN+_A) MPPT_U1.7(OUT_B)
NetMPPT_C2_1: MPPT_C2.1 MPPT_C4.1 MPPT_R8.1 MPPT_R9.2 MPPT_U1.2(IN-_A)
NetMPPT_C2_2: MPPT_C2.2 MPPT_R4.2
NetMPPT_C6_2: MPPT_C6.2 MPPT_R5.1 MPPT_R6.1 MPPT_R7.2 MPPT_U1.5(IN+_B)
NetMPPT_C7_2: MPPT_C7.2 MPPT_R10.1 MPPT_U3.7(IN1)
NetMPPT_C9_2: MPPT_C9.2 MPPT_R12.1 MPPT_U3.5(IN3)
NetMPPT_C10_1: MPPT_C10.1 MPPT_R11.2 MPPT_U4.1(VDD) MPPT_U4.4(VDD) MPPT_U4.5(VDD)
NetMPPT_C11_2: MPPT_C11.2 MPPT_R13.1 MPPT_R14.2 MPPT_U3.4(IN4)
NetMPPT_C12_2: MPPT_C12.2 MPPT_R17.2 MPPT_R18.1 MPPT_U5.3(IN+)
NetMPPT_R1_2: MPPT_R1.2 MPPT_U3.6(IN2) ; port MPPT_MEAS.Voltage
NetMPPT_R5_2: MPPT_R5.2 MPPT_R15.1 MPPT_U5.1(OUT) MPPT_U5.4(IN-)
NetMPPT_R10_2: MPPT_R10.2 ; port MPPT_MEAS.Current
NetMPPT_R12_2: MPPT_R12.2 MPPT_U4.3(OUT)
NetMPPT_R15_2: MPPT_R15.2 MPPT_U2.1(Vout)

### Channels
Top/MPPT X/MPPTX Interface to uC: designators end in _1; ports DCDC_ADJ=NetDCDCX_R7_2 DCDC_Vout=NetEMIXO_C1_1 MPPT_~{Disable}=NetCTRLB_U1_1
Top/MPPT Y+/MPPTY Interface to uC: designators end in _2; ports DCDC_ADJ=NetDCDCY_R7_1_1 DCDC_Vout=NetMPPT_R13_2_2 MPPT_~{Disable}=NetCTRLB_U1_2
Top/MPPT Y-/MPPTY Interface to uC: designators end in _3; ports DCDC_ADJ=NetDCDCY_R7_2_1 DCDC_Vout=NetMPPT_R13_3_2 MPPT_~{Disable}=NetCTRLB_U1_3

### Notes on the sheet
- 10n
- 1k
- Title:
- Project:
- Author:
- Model:
- Document Number:
- Checked by:
- Rev:
- Date:
- Approved by:
- Sheet:
- of
- File name:

### Library data of the parts
MPPT_C3 MPPT_C5 MPPT_C8 MPPT_C10 = Cer_C0603T104K5RALTU: Ceramic Cap Kemet COTS 100n/50V X7R 0603; Manufacturer: Kemet; ManufacturerPartNumber: C0603T104K5RALTU; Value: 100n/50V
MPPT_J1 = 2way: ComponentLink1URL: http://www.edatools.cz/addons; ComponentLink1Description: Source; FootprintNote: LP=12mil, MP=40mil, HP=120mil
MPPT_R1-MPPT_R15 = Res
  MPPT_R1: Value: 47k/1%
  MPPT_R2: Value: 220k/1%
  MPPT_R3: Value: 13k/1%
  MPPT_R4: Value: NC
  MPPT_R5 MPPT_R13: Value: 4.7k/1%
  MPPT_R6 MPPT_R8: Value: 680k/1%
  MPPT_R7 MPPT_R9: Value: 330k/1%
  MPPT_R10 MPPT_R12 MPPT_R14: Value: 1k/1%
  MPPT_R11: Value: 2.2k/1%
  MPPT_R15: Value: 5.6k/1%
MPPT_R16-MPPT_R18 = CRCW06034K70FKxxxx: 4.7k/1% Vishay CRCW 0603 Resistor. 100mW, 100ppm, 75V.; Manufacturer: Vishay; ManufactuerPartNumber: CRCW06034K70FKxxxx
  MPPT_R16: Value: 4.7k/1%
  MPPT_R17: Value: 22k/1%
  MPPT_R18: Value: 11k/1%
MPPT_U1 = LTC6078: Rail-to-rail, quad operational amplifier. Library compatible with LTC608X LTC607X op-amps; Manufacturer: Linear Technology; Value: LTC6078
MPPT_U2 = DAC121S101: 12-Bit Micro Power, RRO Digital-to-Analog Converter.; Manufacturer: Texas Instruments; Value: DAC121S101
MPPT_U3 = ADC124S021CIMM/NOPB: Manufacturer: Texas Instruments; ManufacturerPartNumber: ADC124S021CIMM/NOPB; Value: ADC124S021CIMM
MPPT_U4 = LMT87: Analog Temperature Sensors with Class-AB Output
MPPT_U5 = TLV2370IDBVR: 3-MHz Rail-to-Rail In/Out Single Operational Amplifier; Manufacturer: Texas Instruments; HelpUrl: http://www.ti.com/lit/ds/symlink/tlv2370.pdf; ManufacturerPartNumber: TLV2370IDBVR

## Sheet EPS_MPPT_XY_Measurements.SchDoc: MPPT-X and MPPT-Y / Measurements
size A4; ApprovedBy: (not approved); CheckedBy: (not checked); Author: Piotr Kuligowski; DocumentNumber: PWSat2-xxx-DW-xxx; Revision: 2; SheetNumber: 7; SheetTotal: 51; Model: EM2
Used 3 times, as channels Top/MPPT X/MPPTX Measurements, Top/MPPT Y+/MPPTY Measurements, Top/MPPT Y-/MPPTY Measurements. Parts and nets are listed once, with the designators drawn on the sheet.
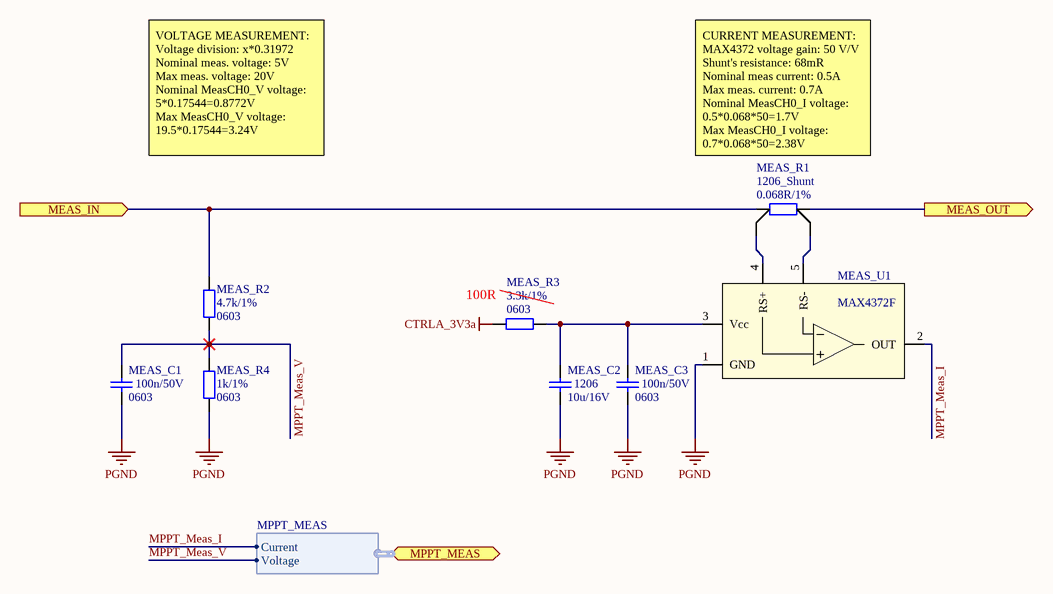
[diagram p17: EPS_MPPT_XY_Measurements.SchDoc]

### Parts
MEAS_C1  Package: 0603  [SMD_Capacitor_0603]  (hidden comment: 100n/50V)
MEAS_C2  Packge: 1206  [SMD_Capacitor_1206]  (hidden comment: 10u/16V)
MEAS_C3  Package: 0603  [SMD_Capacitor_0603]  (hidden comment: 100n/50V)
MEAS_R1  Package: 1206_Shunt  [SMD_Resistor-Shunt_1206]  (hidden comment: 0.068R/1%)
MEAS_R2  Package: 0603  [SMD_Resistor_0603]  (hidden comment: 4.7k/1%)
MEAS_R3  Package: 0603  [SMD_Resistor_0603]  (hidden comment: 3.3k/1%)
MEAS_R4  Package: 0603  [SMD_Resistor_0603]  (hidden comment: 1k/1%)
MEAS_U1  MAX4372F  [SOT23-5]

### Ports
MEAS_IN (in), MEAS_OUT (out), MPPT_MEAS (harness MPPT_MEAS)

### Harnesses
MPPT_MEAS: Voltage, Current

### Nets
CTRLA_3V3a: MEAS_R3.1
PGND: MEAS_C1.2 MEAS_C2.2 MEAS_C3.2 MEAS_R4.2 MEAS_U1.1(GND)
MEAS_IN: MEAS_R1.1 MEAS_R2.1 ; port MEAS_IN
MEAS_OUT: MEAS_R1.4 ; port MEAS_OUT
MPPT_Meas_I: MEAS_U1.2(OUT) ; port MPPT_MEAS.Current
MPPT_Meas_V: MEAS_C1.1 MEAS_R2.2 MEAS_R4.1 ; port MPPT_MEAS.Voltage
NetMEAS_C2_1: MEAS_C2.1 MEAS_C3.1 MEAS_R3.2 MEAS_U1.3(Vcc)
NetMEAS_R1_2: MEAS_R1.2 MEAS_U1.4(RS+)
NetMEAS_R1_3: MEAS_R1.3 MEAS_U1.5(RS-)

### Channels
Top/MPPT X/MPPTX Measurements: designators end in _1; ports MEAS_IN=NetMEAS_R1_1_1 MEAS_OUT=NetMEAS_R1_1_4
Top/MPPT Y+/MPPTY Measurements: designators end in _2; ports MEAS_IN=NetMEAS_R1_2_1 MEAS_OUT=NetMEAS_R1_2_4
Top/MPPT Y-/MPPTY Measurements: designators end in _3; ports MEAS_IN=NetMEAS_R1_3_1 MEAS_OUT=NetMEAS_R1_3_4

### Notes on the sheet
- VOLTAGE MEASUREMENT:
  Voltage division: x*0.31972
  Nominal meas. voltage: 5V
  Max meas. voltage: 20V
  Nominal MeasCH0_V voltage: 5*0.17544=0.8772V
  Max MeasCH0_V voltage: 19.5*0.17544=3.24V
- CURRENT MEASUREMENT:
  MAX4372 voltage gain: 50 V/V
  Shunt's resistance: 68mR
  Nominal meas current: 0.5A
  Max meas. current: 0.7A
  Nominal MeasCH0_I voltage: 0.5*0.068*50=1.7V
  Max MeasCH0_I voltage: 0.7*0.068*50=2.38V
- (near MEAS_R3) 100R
- Title:
- Project:
- Author:
- Model:
- Document Number:
- Checked by:
- Rev:
- Date:
- Approved by:
- Sheet:
- of
- File name:

### Library data of the parts
MEAS_C1 MEAS_C3 = Cer_C0603T104K5RALTU: Ceramic Cap Kemet COTS 100n/50V X7R 0603; Manufacturer: Kemet; ManufacturerPartNumber: C0603T104K5RALTU; Value: 100n/50V
MEAS_C2 = Cer_C1206T106K4RACTU: Ceramic Cap Kemet COTS 10u/16V X7R 1206; ManufacturerPartNumber: C1206T106K4RACTU; Manufacturer: Kemet; Value: 10u/16V
MEAS_R1 = ERJ-8BWFR068V: Panasonic Resistor 68mR 1% 1206 1W; Manufacturer: Panasonic; ManufacturerPartNumber: ERJ-8BWFR068V; Value: 0.068R/1%
MEAS_R2-MEAS_R4 = Res
  MEAS_R2: Value: 4.7k/1%
  MEAS_R3: Value: 3.3k/1%
  MEAS_R4: Value: 1k/1%
MEAS_U1 = MAX4372: High-Side Current-Sense Amplifier with Voltage Output; Manufacturer: Maxim Integrated Products; Value: MAX4372F

## Sheet EPS_MPPT_X_EMI-Filter_Out.SchDoc: MPPT-X / EMI-Filter / Out
size A4; ApprovedBy: (not approved); CheckedBy: (not checked); Author: Piotr Kuligowski; DocumentNumber: PWSat2-xxx-DW-xxx; Revision: 2; SheetNumber: 11; SheetTotal: 51; Model: EM2
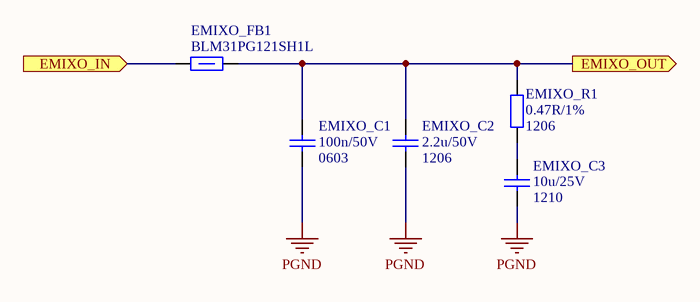
[diagram p18: EPS_MPPT_X_EMI-Filter_Out.SchDoc]

### Parts
EMIXO_C1  Package: 0603  [SMD_Capacitor_0603]  (hidden comment: 100n/50V)
EMIXO_C2  Package: 1206  [SMD_Capacitor_1206]  (hidden comment: 2.2u/50V)
EMIXO_C3  Package: 1210  [SMD_Capacitor_1210]  (hidden comment: 10u/25V)
EMIXO_FB1  120R/100MHz  [SMD_FerriteBead_1206]  (value not drawn)
EMIXO_R1  Package: 1206  [SMD_Resistor_1206]  (hidden comment: 0.47R/1%)

### Ports
EMIXO_IN (in), EMIXO_OUT (out)

### Nets
PGND: EMIXO_C1.2 EMIXO_C2.2 EMIXO_C3.2
NetDCDCX_C2_2: EMIXO_FB1.2 ; port EMIXO_IN
NetEMIXO_C1_1: EMIXO_C1.1 EMIXO_C2.1 EMIXO_FB1.1 EMIXO_R1.2 ; port EMIXO_OUT
NetEMIXO_C3_1: EMIXO_C3.1 EMIXO_R1.1

### Notes on the sheet
- Title:
- Project:
- Author:
- Model:
- Document Number:
- Checked by:
- Rev:
- Date:
- Approved by:
- Sheet:
- of
- File name:

### Library data of the parts
EMIXO_C1 = Cer_C0603T104K5RALTU: Ceramic Cap Kemet COTS 100n/50V X7R 0603; Manufacturer: Kemet; ManufacturerPartNumber: C0603T104K5RALTU; Value: 100n/50V
EMIXO_C2 = Cer_GCJ31CR71H225KA12L: Ceramic Cap Murata Automotive 2.2u/50V X7R 1206; Manufacturer: Murata; ManufacturerPartNumber: GCJ31CR71H225KA12L; Value: 2.2u/50V
EMIXO_C3 = Cer_GCJ32ER71E106KA12L: as DCDCX_C3-DCDCX_C6 on sheet EPS_MPPT_X_Boost-Converter; Manufacturer: Murata; ManufacturerPartNumber: GCJ32ER71E106KA12L; Value: 10u/25V
EMIXO_FB1 = BLM31PG121SH1L: as EMIXS_FB1-EMIXS_FB3 on sheet EPS_MPPT_X_EMI-Filter_Solar-Panels; Package: 1206; Value: 120R/100MHz; ManufacturerPartNumber: BLM31PG121SH1L
EMIXO_R1 = ERJ-8BQFR47V: Panasonic Resistor 0.47R 1% 1206 330mW; ManufacturerPartNumber: ERJ-8BQFR47V; Manufacturer: Panasonic; Value: 0.47R/1%

## Sheet EPS_MPPT_X_OR_MPB.SchDoc: MPPT-X / MPB ORing
size A4; ApprovedBy: (not approved); CheckedBy: (not checked); Author: Piotr Kuligowski; DocumentNumber: PWSat2-xxx-DW-xxx; Revision: 2; SheetNumber: 12; SheetTotal: 51; Model: EM2
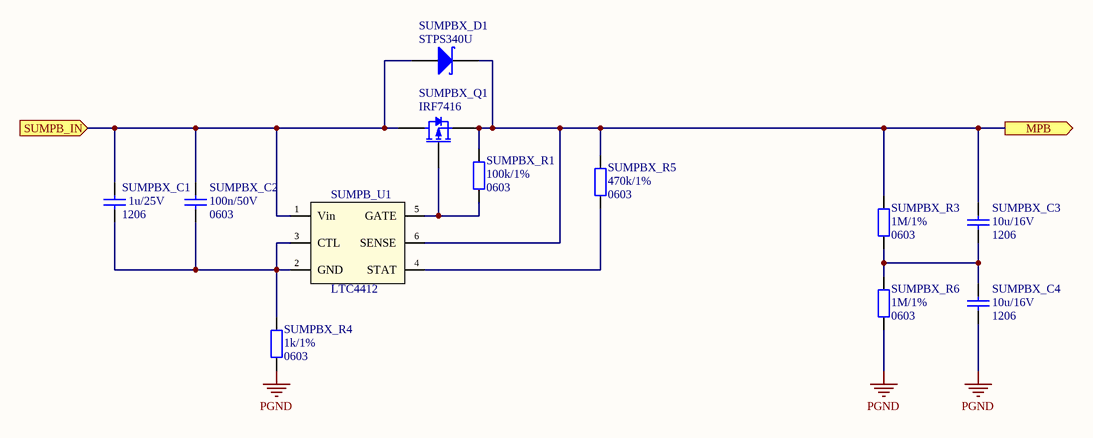
[diagram p19: EPS_MPPT_X_OR_MPB.SchDoc]

### Parts
SUMPB_U1  LTC4412  [SOT23-6]
SUMPBX_C1  Package: 1206  [SMD_Capacitor_1206]  (hidden comment: 1u/25V)
SUMPBX_C2  Package: 0603  [SMD_Capacitor_0603]  (hidden comment: 100n/50V)
SUMPBX_C3  Packge: 1206  [SMD_Capacitor_1206]  (hidden comment: 10u/16V)
SUMPBX_C4  Packge: 1206  [SMD_Capacitor_1206]  (hidden comment: 10u/16V)
SUMPBX_D1  STPS340U  [DO-214AA]
SUMPBX_Q1  IRF7416  [SOIC-8-N_SSSGDDDD]
SUMPBX_R1  Package: 0603  [SMD_Resistor_0603]  (hidden comment: 100k/1%)
SUMPBX_R3  Package: 0603  [SMD_Resistor_0603]  (hidden comment: 1M/1%)
SUMPBX_R4  Package: 0603  [SMD_Resistor_0603]  (hidden comment: 1k/1%)
SUMPBX_R5  Package: 0603  [SMD_Resistor_0603]  (hidden comment: 470k/1%)
SUMPBX_R6  Package: 0603  [SMD_Resistor_0603]  (hidden comment: 1M/1%)

### Ports
MPB (out), SUMPB_IN (in)

### Nets
PGND: SUMPBX_C4.2 SUMPBX_R4.2 SUMPBX_R6.2
NetEMIXO_C1_1: SUMPB_U1.1(Vin) SUMPBX_C1.1 SUMPBX_C2.1 SUMPBX_D1.A SUMPBX_Q1.D ; port SUMPB_IN
NetH3_2: SUMPB_U1.6(SENSE) SUMPBX_C3.1 SUMPBX_D1.K SUMPBX_Q1.S SUMPBX_R1.1 SUMPBX_R3.1 SUMPBX_R5.1 ; port MPB
NetSUMPB_U1_2: SUMPB_U1.2(GND) SUMPB_U1.3(CTL) SUMPBX_C1.2 SUMPBX_C2.2 SUMPBX_R4.1
NetSUMPB_U1_4: SUMPB_U1.4(STAT) SUMPBX_R5.2
NetSUMPB_U1_5: SUMPB_U1.5(GATE) SUMPBX_Q1.G SUMPBX_R1.2
NetSUMPBX_C3_2: SUMPBX_C3.2 SUMPBX_C4.1 SUMPBX_R3.2 SUMPBX_R6.1

### Notes on the sheet
- Title:
- Project:
- Author:
- Model:
- Document Number:
- Checked by:
- Rev:
- Date:
- Approved by:
- Sheet:
- of
- File name:

### Library data of the parts
SUMPB_U1 = LTC4412: Ideal Diode, Low Loss PowerPath Controller.; Manufacturer: Linear Technology; Value: LTC4412
SUMPBX_C1 = Cer_C1206T105K3RALTU: Ceramic Cap Kemet COTS 1u/25V X7R 1206; ManufacturerPartNumber: C1206T105K3RALTU; Manufacturer: Kemet; Value: 1u/25V
SUMPBX_C2 = Cer_GCJ188R71H104KA12D: Ceramic Cap Murata Automotive 100n/50V X7R 0603; Manufacturer: Murata; ManufacturerPartNumber: GCJ188R71H104KA12D; Value: 100n/50V
SUMPBX_C3 SUMPBX_C4 = Cer_C1206T106K4RACTU: Ceramic Cap Kemet COTS 10u/16V X7R 1206; ManufacturerPartNumber: C1206T106K4RACTU; Manufacturer: Kemet; Value: 10u/16V
SUMPBX_D1 = STPS340x: as DCDCX_D1 on sheet EPS_MPPT_X_Boost-Converter; Value: STPS340U
SUMPBX_Q1 = IRF7416: 10A/30V HEXFET Power P-MOSFET.; Manufacturer: International Rectifier; Value: IRF7416
SUMPBX_R1 SUMPBX_R3-SUMPBX_R6 = Res
  SUMPBX_R1: Value: 100k/1%
  SUMPBX_R3 SUMPBX_R6: Value: 1M/1%
  SUMPBX_R4: Value: 1k/1%
  SUMPBX_R5: Value: 470k/1%

## Sheet EPS_MPPT_Y.SchDoc: MPPT-Y
size A3; ApprovedBy: (not approved); CheckedBy: (not checked); Author: Piotr Kuligowski; DocumentNumber: PWSat2-xxx-DW-xxx; Revision: 2; SheetNumber: 17; SheetTotal: 51; Model: EM2
Used 2 times, as channels Top/MPPT Y+, Top/MPPT Y-. Parts and nets are listed once, with the designators drawn on the sheet.
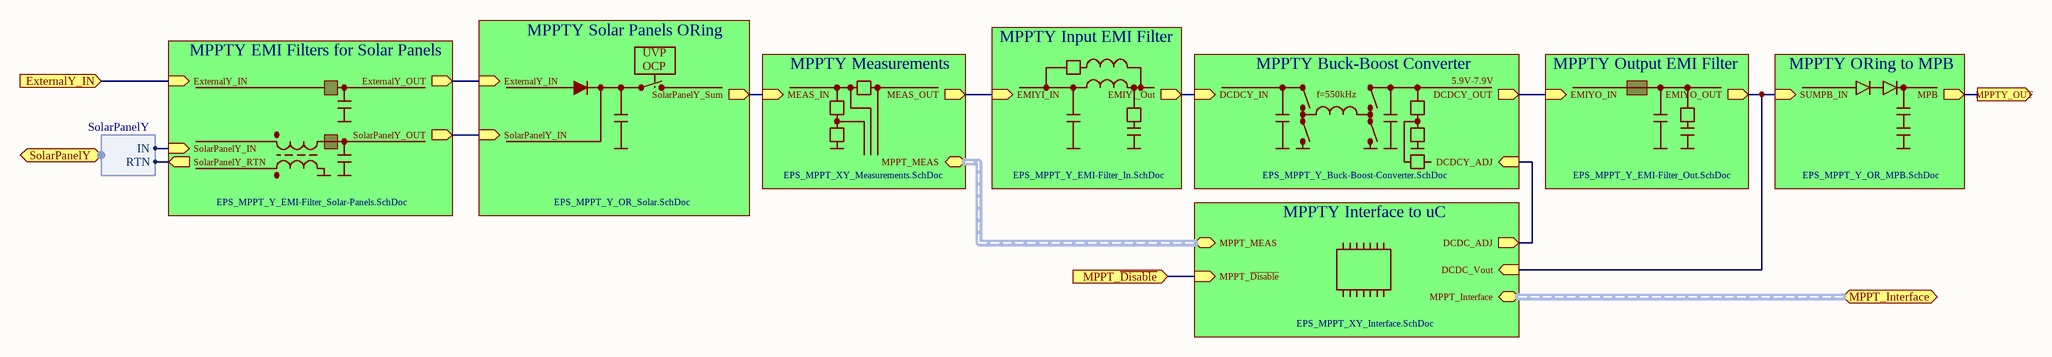
[diagram p20: EPS_MPPT_Y.SchDoc]

### Sub-sheets
MPPTY Buck-Boost Converter = EPS_MPPT_Y_Buck-Boost-Converter.SchDoc: DCDCY_IN (in), DCDCY_OUT (out), DCDCY_ADJ (in)
MPPTY EMI Filters for Solar Panels = EPS_MPPT_Y_EMI-Filter_Solar-Panels.SchDoc (file not in this document): SolarPanelY_IN (in), ExternalY_IN (in), SolarPanelY_RTN (out), ExternalY_OUT (out), SolarPanelY_OUT (out)
MPPTY Input EMI Filter = EPS_MPPT_Y_EMI-Filter_In.SchDoc (file not in this document): EMIYI_Out (out), EMIYI_IN (in)
MPPTY Interface to uC = EPS_MPPT_XY_Interface.SchDoc: DCDC_ADJ (out), MPPT_Interface (harness MPPT_Interface), MPPT_MEAS (harness MPPT_MEAS), DCDC_Vout (in), MPPT_~{Disable} (in)
MPPTY Measurements = EPS_MPPT_XY_Measurements.SchDoc: MEAS_IN (in), MEAS_OUT (out), MPPT_MEAS (harness MPPT_MEAS)
MPPTY ORing to MPB = EPS_MPPT_Y_OR_MPB.SchDoc: SUMPB_IN (in), MPB (out)
MPPTY Output EMI Filter = EPS_MPPT_Y_EMI-Filter_Out.SchDoc (file not in this document): EMIYO_IN (in), EMIYO_OUT (out)
MPPTY Solar Panels ORing = EPS_MPPT_Y_OR_Solar.SchDoc: ExternalY_IN (in), SolarPanelY_IN (in), SolarPanelY_Sum (out)

### Ports
ExternalY_IN (in), MPPT_Interface (harness MPPT_Interface), MPPT_~{Disable} (in), MPPTY_OUT (out), SolarPanelY (harness SolarPanelY)

### Harnesses
SolarPanelY: IN, RTN

### Nets
ExternalY_IN: port ExternalY_IN, sheet MPPTY EMI Filters for Solar Panels/ExternalY_IN
MPPT_~{Disable}: port MPPT_~{Disable}, sheet MPPTY Interface to uC/MPPT_~{Disable}
MPPTY_OUT: port MPPTY_OUT, sheet MPPTY ORing to MPB/MPB
(unnamed): sheet MPPTY Buck-Boost Converter/DCDCY_IN, sheet MPPTY Input EMI Filter/EMIYI_Out
(unnamed): sheet MPPTY Buck-Boost Converter/DCDCY_OUT, sheet MPPTY Output EMI Filter/EMIYO_IN
(unnamed): sheet MPPTY Buck-Boost Converter/DCDCY_ADJ, sheet MPPTY Interface to uC/DCDC_ADJ
(unnamed): sheet MPPTY Solar Panels ORing/ExternalY_IN, sheet MPPTY EMI Filters for Solar Panels/ExternalY_OUT
(unnamed): sheet MPPTY Solar Panels ORing/SolarPanelY_IN, sheet MPPTY EMI Filters for Solar Panels/SolarPanelY_OUT
(unnamed): sheet MPPTY Solar Panels ORing/SolarPanelY_Sum, sheet MPPTY Measurements/MEAS_IN
(unnamed): sheet MPPTY EMI Filters for Solar Panels/SolarPanelY_IN, port SolarPanelY.IN
(unnamed): sheet MPPTY EMI Filters for Solar Panels/SolarPanelY_RTN, port SolarPanelY.RTN
(unnamed): sheet MPPTY Interface to uC/DCDC_Vout, sheet MPPTY Output EMI Filter/EMIYO_OUT, sheet MPPTY ORing to MPB/SUMPB_IN
(unnamed): sheet MPPTY Measurements/MEAS_OUT, sheet MPPTY Input EMI Filter/EMIYI_IN

### Channels
Top/MPPT Y+: ports ExternalY_IN=PC-104_EXTY+ MPPT_~{Disable}=NetCTRLB_U1_2 MPPTY_OUT=NetH3_2
Top/MPPT Y-: ports ExternalY_IN=PC-104_EXTY- MPPT_~{Disable}=NetCTRLB_U1_3 MPPTY_OUT=NetH3_2

### Buses and harness runs
harness port MPPT_Interface = sheet MPPTY Interface to uC/MPPT_Interface
harness sheet MPPTY Interface to uC/MPPT_MEAS = sheet MPPTY Measurements/MPPT_MEAS

### Notes on the sheet
- UVP
- OCP
- f=550kHz
- 5.9V-7.9V
- Title:
- Project:
- Author:
- Model:
- Document Number:
- Checked by:
- Rev:
- Date:
- Approved by:
- Sheet:
- of
- File name:

## Sheet EPS_MPPT_Y_Buck-Boost-Converter.SchDoc: Controlled Buck-Boost Converter CH1
size A4; Date: 2016-01-06; Author: Piotr Kuligowski; DocumentNumber: PWSat2-xxx-DW-xxx; Revision: 1-0; SheetNumber: 21; SheetTotal: 51; Model: EM1
Used 2 times, as channels Top/MPPT Y+/MPPTY Buck-Boost Converter, Top/MPPT Y-/MPPTY Buck-Boost Converter. Parts and nets are listed once, with the designators drawn on the sheet.
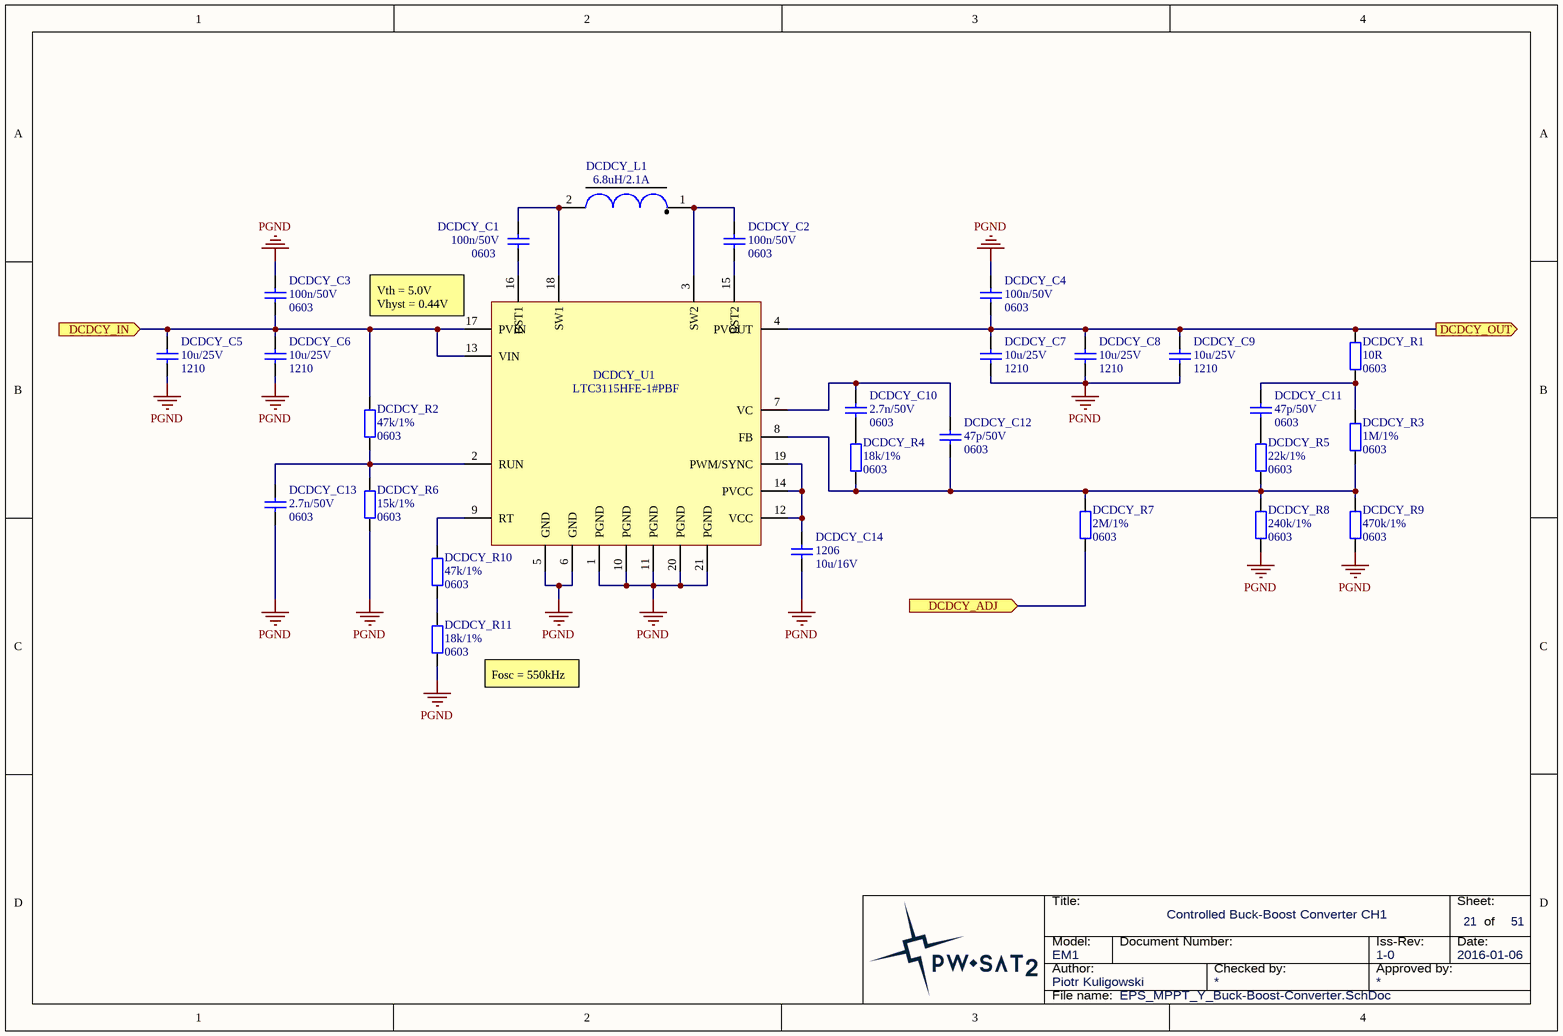
[diagram p21: EPS_MPPT_Y_Buck-Boost-Converter.SchDoc]

### Parts
DCDCY_C1  Package: 0603  [SMD_Capacitor_0603]  (hidden comment: 100n/50V)
DCDCY_C2  Package: 0603  [SMD_Capacitor_0603]  (hidden comment: 100n/50V)
DCDCY_C3  Package: 0603  [SMD_Capacitor_0603]  (hidden comment: 100n/50V)
DCDCY_C4  Package: 0603  [SMD_Capacitor_0603]  (hidden comment: 100n/50V)
DCDCY_C5  Package: 1210  [SMD_Capacitor_1210]  (hidden comment: 10u/25V)
DCDCY_C6  Package: 1210  [SMD_Capacitor_1210]  (hidden comment: 10u/25V)
DCDCY_C7  Package: 1210  [SMD_Capacitor_1210]  (hidden comment: 10u/25V)
DCDCY_C8  Package: 1210  [SMD_Capacitor_1210]  (hidden comment: 10u/25V)
DCDCY_C9  Package: 1210  [SMD_Capacitor_1210]  (hidden comment: 10u/25V)
DCDCY_C10  value 2.7n/50V  Package: 0603  [SMD_Capacitor_0603]  (hidden comment: Cap)
DCDCY_C11  value 47p/50V  Package: 0603  [SMD_Capacitor_0603]  (hidden comment: Cap)
DCDCY_C12  value 47p/50V  Package: 0603  [SMD_Capacitor_0603]  (hidden comment: Cap)
DCDCY_C13  value 2.7n/50V  Package: 0603  [SMD_Capacitor_0603]  (hidden comment: Cap)
DCDCY_C14  Packge: 1206  [SMD_Capacitor_1206]  (hidden comment: 10u/16V)
DCDCY_L1  6.8uH/2.1A  [Coilcraft_MSS6132]
DCDCY_R1  Package: 0603  [SMD_Resistor_0603]  (hidden comment: 10R)
DCDCY_R2  Package: 0603  [SMD_Resistor_0603]  (hidden comment: 47k/1%)
DCDCY_R3  Package: 0603  [SMD_Resistor_0603]  (hidden comment: 1M/1%)
DCDCY_R4  Package: 0603  [SMD_Resistor_0603]  (hidden comment: 18k/1%)
DCDCY_R5  Package: 0603  [SMD_Resistor_0603]  (hidden comment: 22k/1%)
DCDCY_R6  Package: 0603  [SMD_Resistor_0603]  (hidden comment: 15k/1%)
DCDCY_R7  Package: 0603  [SMD_Resistor_0603]  (hidden comment: 2M/1%)
DCDCY_R8  Package: 0603  [SMD_Resistor_0603]  (hidden comment: 240k/1%)
DCDCY_R9  Package: 0603  [SMD_Resistor_0603]  (hidden comment: 470k/1%)
DCDCY_R10  Package: 0603  [SMD_Resistor_0603]  (hidden comment: 47k/1%)
DCDCY_R11  Package: 0603  [SMD_Resistor_0603]  (hidden comment: 18k/1%)
DCDCY_U1  LTC3115HFE-1#PBF  [LT-FE-20-EPV-CA_N]

### Ports
DCDCY_ADJ (in), DCDCY_IN (in), DCDCY_OUT (out)

### Nets
PGND: DCDCY_C3.1 DCDCY_C4.1 DCDCY_C5.2 DCDCY_C6.2 DCDCY_C7.2 DCDCY_C8.2 DCDCY_C9.2 DCDCY_C13.2 DCDCY_C14.2 DCDCY_R6.2 DCDCY_R8.2 DCDCY_R9.2 DCDCY_R11.2 DCDCY_U1.1(PGND) DCDCY_U1.5(GND) DCDCY_U1.6(GND) DCDCY_U1.10(PGND) DCDCY_U1.11(PGND) DCDCY_U1.20(PGND) DCDCY_U1.21(PGND)
DCDCY_ADJ: DCDCY_R7.1 ; port DCDCY_ADJ
DCDCY_IN: DCDCY_C3.2 DCDCY_C5.1 DCDCY_C6.1 DCDCY_R2.1 DCDCY_U1.13(VIN) DCDCY_U1.17(PVIN) ; port DCDCY_IN
DCDCY_OUT: DCDCY_C4.2 DCDCY_C7.1 DCDCY_C8.1 DCDCY_C9.1 DCDCY_R1.1 DCDCY_U1.4(PVOUT) ; port DCDCY_OUT
NetDCDCY_C1_1: DCDCY_C1.1 DCDCY_L1.2 DCDCY_U1.18(SW1)
NetDCDCY_C1_2: DCDCY_C1.2 DCDCY_U1.16(BST1)
NetDCDCY_C2_1: DCDCY_C2.1 DCDCY_L1.1 DCDCY_U1.3(SW2)
NetDCDCY_C2_2: DCDCY_C2.2 DCDCY_U1.15(BST2)
NetDCDCY_C10_1: DCDCY_C10.1 DCDCY_C12.1 DCDCY_U1.7(VC)
NetDCDCY_C10_2: DCDCY_C10.2 DCDCY_R4.1
NetDCDCY_C11_1: DCDCY_C11.1 DCDCY_R1.2 DCDCY_R3.1
NetDCDCY_C11_2: DCDCY_C11.2 DCDCY_R5.1
NetDCDCY_C12_2: DCDCY_C12.2 DCDCY_R3.2 DCDCY_R4.2 DCDCY_R5.2 DCDCY_R7.2 DCDCY_R8.1 DCDCY_R9.1 DCDCY_U1.8(FB)
NetDCDCY_C13_1: DCDCY_C13.1 DCDCY_R2.2 DCDCY_R6.1 DCDCY_U1.2(RUN)
NetDCDCY_C14_1: DCDCY_C14.1 DCDCY_U1.12(VCC) DCDCY_U1.14(PVCC) DCDCY_U1.19(PWM/SYNC)
NetDCDCY_R10_1: DCDCY_R10.1 DCDCY_U1.9(RT)
NetDCDCY_R10_2: DCDCY_R10.2 DCDCY_R11.1

### Channels
Top/MPPT Y+/MPPTY Buck-Boost Converter: designators end in _1; ports DCDCY_ADJ=NetDCDCY_R7_1_1 DCDCY_IN=NetDCDCY_C3_1_2 DCDCY_OUT=NetDCDCY_C4_1_2
Top/MPPT Y-/MPPTY Buck-Boost Converter: designators end in _2; ports DCDCY_ADJ=NetDCDCY_R7_2_1 DCDCY_IN=NetDCDCY_C3_2_2 DCDCY_OUT=NetDCDCY_C4_2_2

### Notes on the sheet
- (near DCDCY_U1) Vth = 5.0V
  Vhyst = 0.44V
- (near DCDCY_R11) Fosc = 550kHz
- Title:
- Sheet:
- of
- Author:
- Model:
- Document Number:
- Checked by:
- Iss-Rev:
- Approved by:
- Date:
- File name:

### Library data of the parts
DCDCY_C1-DCDCY_C4 = Cer_C0603T104K5RALTU: Ceramic Cap Kemet COTS 100n/50V X7R 0603; Manufacturer: Kemet; ManufacturerPartNumber: C0603T104K5RALTU; Value: 100n/50V
DCDCY_C5-DCDCY_C9 = Cer_GCJ32ER71E106KA12L: as DCDCX_C3-DCDCX_C6 on sheet EPS_MPPT_X_Boost-Converter; Manufacturer: Murata; ManufacturerPartNumber: GCJ32ER71E106KA12L; Value: 10u/25V
DCDCY_C14 = Cer_C1206T106K4RACTU: Ceramic Cap Kemet COTS 10u/16V X7R 1206; ManufacturerPartNumber: C1206T106K4RACTU; Manufacturer: Kemet; Value: 10u/16V
DCDCY_L1 = MSS6132-682MLx: Coilcraft MSS6132 Inductor, L=6.8uH, Irise20deg=2.1A, ESR=52mR, SRF=47MHz.; Manufacturer: Coilcraft; ManufacturerPartNumber: MSS6132-682MLx; Value: 6.8uH/2.1A
DCDCY_R1-DCDCY_R6 DCDCY_R8-DCDCY_R11 = Res
  DCDCY_R1: Value: 10R
  DCDCY_R2 DCDCY_R10: Value: 47k/1%
  DCDCY_R3: Value: 1M/1%
  DCDCY_R4 DCDCY_R11: Value: 18k/1%
  DCDCY_R5: Value: 22k/1%
  DCDCY_R6: Value: 15k/1%
  DCDCY_R8: Value: 240k/1%
  DCDCY_R9: Value: 470k/1%
DCDCY_R7 = CRCW06032M00FKxxxx: 2M/1% Vishay CRCW 0603 Resistor. 100mW, 200ppm, 75V.; ManufacturerPartNumber: CRCW06032M00FKxxxx; Manufacturer: Vishay; Value: 2M/1%
DCDCY_U1 = LTC3115HFE-1#PBF: 40V, 2A Synchronous Buck-Boost DC/DC Converter, 20-pin SOP (FE-20-EPV-CA), -40 to 150 degC, Pb-Free; Manufacturer: Linear Technology; Package: FE-20-EPV-CA; Value: LTC3115HFE-1#PBF

## Sheet EPS_MPPT_Y_OR_Solar.SchDoc: MPPT-Y / Solar Panels ORing
size A4; ApprovedBy: (not approved); CheckedBy: (not checked); Author: Piotr Kuligowski; DocumentNumber: PWSat2-xxx-DW-xxx; Revision: 2; SheetNumber: 19; SheetTotal: 51; Model: EM2
Used 2 times, as channels Top/MPPT Y+/MPPTY Solar Panels ORing, Top/MPPT Y-/MPPTY Solar Panels ORing. Parts and nets are listed once, with the designators drawn on the sheet.
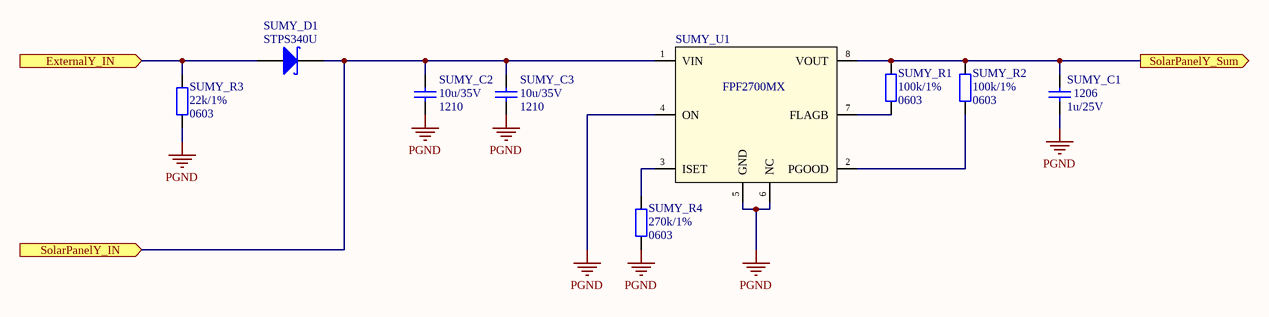
[diagram p22: EPS_MPPT_Y_OR_Solar.SchDoc]

### Parts
SUMY_C1  Package: 1206  [SMD_Capacitor_1206]  (hidden comment: 1u/25V)
SUMY_C2  Package: 1210  [SMD_Capacitor_1210]  (hidden comment: 10u/35V)
SUMY_C3  Package: 1210  [SMD_Capacitor_1210]  (hidden comment: 10u/35V)
SUMY_D1  STPS340U  [DO-214AA]
SUMY_R1  Package: 0603  [SMD_Resistor_0603]  (hidden comment: 100k/1%)
SUMY_R2  Package: 0603  [SMD_Resistor_0603]  (hidden comment: 100k/1%)
SUMY_R3  Package: 0603  [SMD_Resistor_0603]  (hidden comment: 22k/1%)
SUMY_R4  Package: 0603  [SMD_Resistor_0603]  (hidden comment: 270k/1%)
SUMY_U1  FPF2700MX  [SOIC-8-N]

### Ports
ExternalY_IN (in), SolarPanelY_IN (in), SolarPanelY_Sum (out)

### Nets
PGND: SUMY_C1.2 SUMY_C2.2 SUMY_C3.2 SUMY_R3.2 SUMY_R4.2 SUMY_U1.4(ON) SUMY_U1.5(GND) SUMY_U1.6(NC)
ExternalY_IN: SUMY_D1.A SUMY_R3.1 ; port ExternalY_IN
SolarPanelY_IN: SUMY_C2.1 SUMY_C3.1 SUMY_D1.K SUMY_U1.1(VIN) ; port SolarPanelY_IN
SolarPanelY_Sum: SUMY_C1.1 SUMY_R1.1 SUMY_R2.1 SUMY_U1.8(VOUT) ; port SolarPanelY_Sum
NetSUMY_R1_2: SUMY_R1.2 SUMY_U1.7(FLAGB)
NetSUMY_R2_2: SUMY_R2.2 SUMY_U1.2(PGOOD)
NetSUMY_R4_1: SUMY_R4.1 SUMY_U1.3(ISET)

### Channels
Top/MPPT Y+/MPPTY Solar Panels ORing: designators end in _1; ports ExternalY_IN=NetSUMY_D1_1_A SolarPanelY_IN=NetSUMY_C2_1_1 SolarPanelY_Sum=NetMEAS_R1_2_1
Top/MPPT Y-/MPPTY Solar Panels ORing: designators end in _2; ports ExternalY_IN=NetSUMY_D1_2_A SolarPanelY_IN=NetSUMY_C2_2_1 SolarPanelY_Sum=NetMEAS_R1_3_1

### Notes on the sheet
- Title:
- Project:
- Author:
- Model:
- Document Number:
- Checked by:
- Rev:
- Date:
- Approved by:
- Sheet:
- of
- File name:

### Library data of the parts
SUMY_C1 = Cer_C1206T105K3RALTU: Ceramic Cap Kemet COTS 1u/25V X7R 1206; ManufacturerPartNumber: C1206T105K3RALTU; Manufacturer: Kemet; Value: 1u/25V
SUMY_C2 SUMY_C3 = Cer_GCM32EC7YA106KA03K: as SUMX_C2 on sheet EPS_MPPT_X_OR_Solar; Manufacturer: Murata; ManufacturerPartNumber: GCM32EC7YA106KA03K; Value: 10u/35V
SUMY_D1 = STPS340x: as DCDCX_D1 on sheet EPS_MPPT_X_Boost-Converter; Value: STPS340U
SUMY_R1-SUMY_R4 = Res
  SUMY_R1 SUMY_R2: Value: 100k/1%
  SUMY_R3: Value: 22k/1%
  SUMY_R4: Value: 270k/1%
SUMY_U1 = FPF2700MX: as SUMX_U1 on sheet EPS_MPPT_X_OR_Solar; Value: FPF2700MX